# Altium project Evaluation Board.PrjPCB (part 1 of 3)
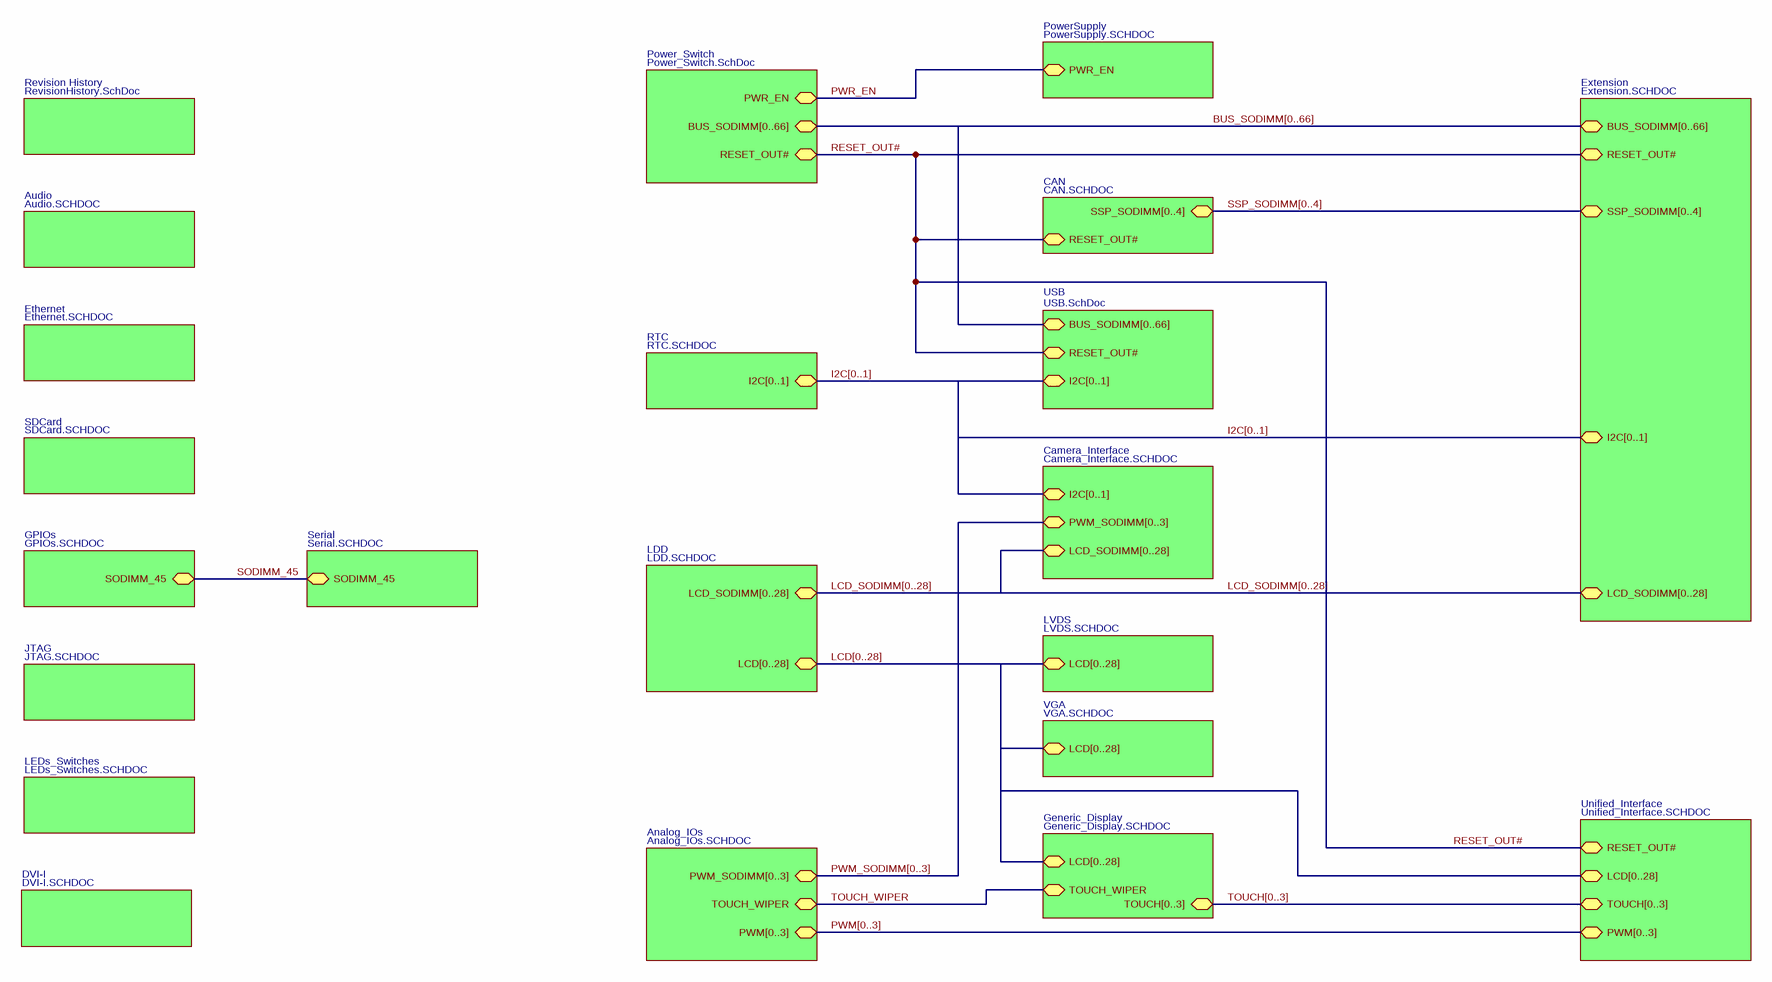
[diagram p0: Hardware_Architecture.SchDoc]
20 sheets, 461 parts. Net scope: global (net labels, ports and power ports of the same name join across sheets).
Board file: Evaluation Board.PcbDoc
Sheets:
  Hardware_Architecture.SchDoc
    LVDS = LVDS.SchDoc
    Generic_Display = Generic_Display.SchDoc
    SDCard = SDCard.SchDoc
    Extension = Extension.SCHDOC
    Ethernet = Ethernet.SchDoc
    Audio = Audio.SchDoc
    USB = USB.SchDoc
    RTC = RTC.SchDoc
    VGA = VGA.SchDoc
    Analog_IOs = Analog_IOs.SCHDOC
    Camera_Interface = Camera_Interface.SCHDOC
    Power_Switch = Power_Switch.SchDoc
    CAN = CAN.SchDoc
    JTAG = JTAG.SchDoc
    LEDs_Switches = LEDs_Switches.SchDoc
    GPIOs = GPIOs.SchDoc
    Unified_Interface = Unified_Interface.SchDoc
    DVI-I = DVI-I.SchDoc
    Revision History = RevisionHistory.SchDoc

## Sheet Hardware_Architecture.SchDoc: Evaluation Board 3.2
size A3; Organization: Toradex AG; Address1: Altsagenstrasse 5; Address2: Horw; Address3: 6048; Address4: Switzerland; DocumentNumber: 2; Revision: V3.2; SheetNumber: 2; SheetTotal: 23; PageSetup: Record=PageOptions|CenterHorizontal=True|CenterVertical=True|PrintScale=0.73|XCorrection=1.00|YCorrection=1.00|PrintKind=0|BorderSize=5000000|LeftOffset=0|BottomOffset=0|Orientation=2|PaperLength=1000|PaperWidth=1000|Scale=100|PaperSource=7|PrintQuality=600|MediaType=1|DitherType=10|PaperKind=A4|PrintScaleMode=1

### Sub-sheets
Analog_IOs = Analog_IOs.SCHDOC: TOUCH_WIPER (bidir), PWM_SODIMM[0..3] (bidir), PWM[0..3] (bidir)
Audio = Audio.SCHDOC: no entries
Camera_Interface = Camera_Interface.SCHDOC: I2C[0..1] (bidir), PWM_SODIMM[0..3] (bidir), LCD_SODIMM[0..28] (bidir)
CAN = CAN.SCHDOC: RESET_OUT# (bidir), SSP_SODIMM[0..4] (bidir)
DVI-I = DVI-I.SCHDOC: no entries
Ethernet = Ethernet.SCHDOC: no entries
Extension = Extension.SCHDOC: I2C[0..1] (bidir), SSP_SODIMM[0..4] (bidir), RESET_OUT# (bidir), LCD_SODIMM[0..28] (bidir), BUS_SODIMM[0..66] (bidir)
Generic_Display = Generic_Display.SCHDOC: LCD[0..28] (bidir), TOUCH_WIPER (bidir), TOUCH[0..3] (bidir)
GPIOs = GPIOs.SCHDOC: SODIMM_45 (bidir)
JTAG = JTAG.SCHDOC: no entries
LDD = LDD.SCHDOC (file not in this document): LCD[0..28] (bidir), LCD_SODIMM[0..28] (bidir)
LEDs_Switches = LEDs_Switches.SCHDOC: no entries
LVDS = LVDS.SCHDOC: LCD[0..28] (bidir)
Power_Switch = Power_Switch.SchDoc: RESET_OUT# (bidir), PWR_EN (bidir), BUS_SODIMM[0..66] (bidir)
PowerSupply = PowerSupply.SCHDOC (file not in this document): PWR_EN (bidir)
Revision History = RevisionHistory.SchDoc: no entries
RTC = RTC.SCHDOC: I2C[0..1] (bidir)
SDCard = SDCard.SCHDOC: no entries
Serial = Serial.SCHDOC (file not in this document): SODIMM_45 (bidir)
Unified_Interface = Unified_Interface.SCHDOC: LCD[0..28] (bidir), TOUCH[0..3] (bidir), PWM[0..3] (bidir), RESET_OUT# (bidir)
USB = USB.SchDoc: RESET_OUT# (bidir), I2C[0..1] (bidir), BUS_SODIMM[0..66] (bidir)
VGA = VGA.SCHDOC: LCD[0..28] (bidir)

### Nets
PWR_EN: sheet PowerSupply/PWR_EN, sheet Power_Switch/PWR_EN
RESET_OUT#: sheet Extension/RESET_OUT#, sheet USB/RESET_OUT#, sheet Power_Switch/RESET_OUT#, sheet CAN/RESET_OUT#, sheet Unified_Interface/RESET_OUT#
SODIMM_45: sheet Serial/SODIMM_45, sheet GPIOs/SODIMM_45
TOUCH_WIPER: sheet Generic_Display/TOUCH_WIPER, sheet Analog_IOs/TOUCH_WIPER

### Buses and harness runs
bus BUS_SODIMM[0..66] = sheet Extension/BUS_SODIMM[0..66] = sheet Power_Switch/BUS_SODIMM[0..66] = sheet USB/BUS_SODIMM[0..66]
bus I2C[0..1] = sheet Camera_Interface/I2C[0..1] = sheet Extension/I2C[0..1] = sheet RTC/I2C[0..1] = sheet USB/I2C[0..1]
bus LCD[0..28] = sheet Generic_Display/LCD[0..28] = sheet LDD/LCD[0..28] = sheet LVDS/LCD[0..28] = sheet Unified_Interface/LCD[0..28] = sheet VGA/LCD[0..28]
bus LCD_SODIMM[0..28] = sheet Camera_Interface/LCD_SODIMM[0..28] = sheet Extension/LCD_SODIMM[0..28] = sheet LDD/LCD_SODIMM[0..28]
bus PWM[0..3] = sheet Analog_IOs/PWM[0..3] = sheet Unified_Interface/PWM[0..3]
bus PWM_SODIMM[0..3] = sheet Analog_IOs/PWM_SODIMM[0..3] = sheet Camera_Interface/PWM_SODIMM[0..3]
bus SSP_SODIMM[0..4] = sheet CAN/SSP_SODIMM[0..4] = sheet Extension/SSP_SODIMM[0..4]
bus TOUCH[0..3] = sheet Generic_Display/TOUCH[0..3] = sheet Unified_Interface/TOUCH[0..3]

### Notes on the sheet
- Title
- Size:
- Date:
- A3
- Number:
- Time:
- Revision:
- Sheet
- of
- File:

## Sheet LVDS.SchDoc: Evaluation Board 3.2
size A3; Organization: Toradex AG; Address1: Altsagenstrasse 5; Address2: Horw; Address3: 6048; Address4: Switzerland; DocumentNumber: 17; Revision: V3.2; SheetNumber: 17; SheetTotal: 23; PageSetup: Record=PageOptions|CenterHorizontal=True|CenterVertical=True|PrintScale=0.73|XCorrection=1.00|YCorrection=1.00|PrintKind=0|BorderSize=5000000|LeftOffset=0|BottomOffset=0|Orientation=2|PaperLength=1000|PaperWidth=1000|Scale=100|PaperSource=7|PrintQuality=-4|MediaType=1|DitherType=10|PaperKind=A4|PrintScaleMode=1
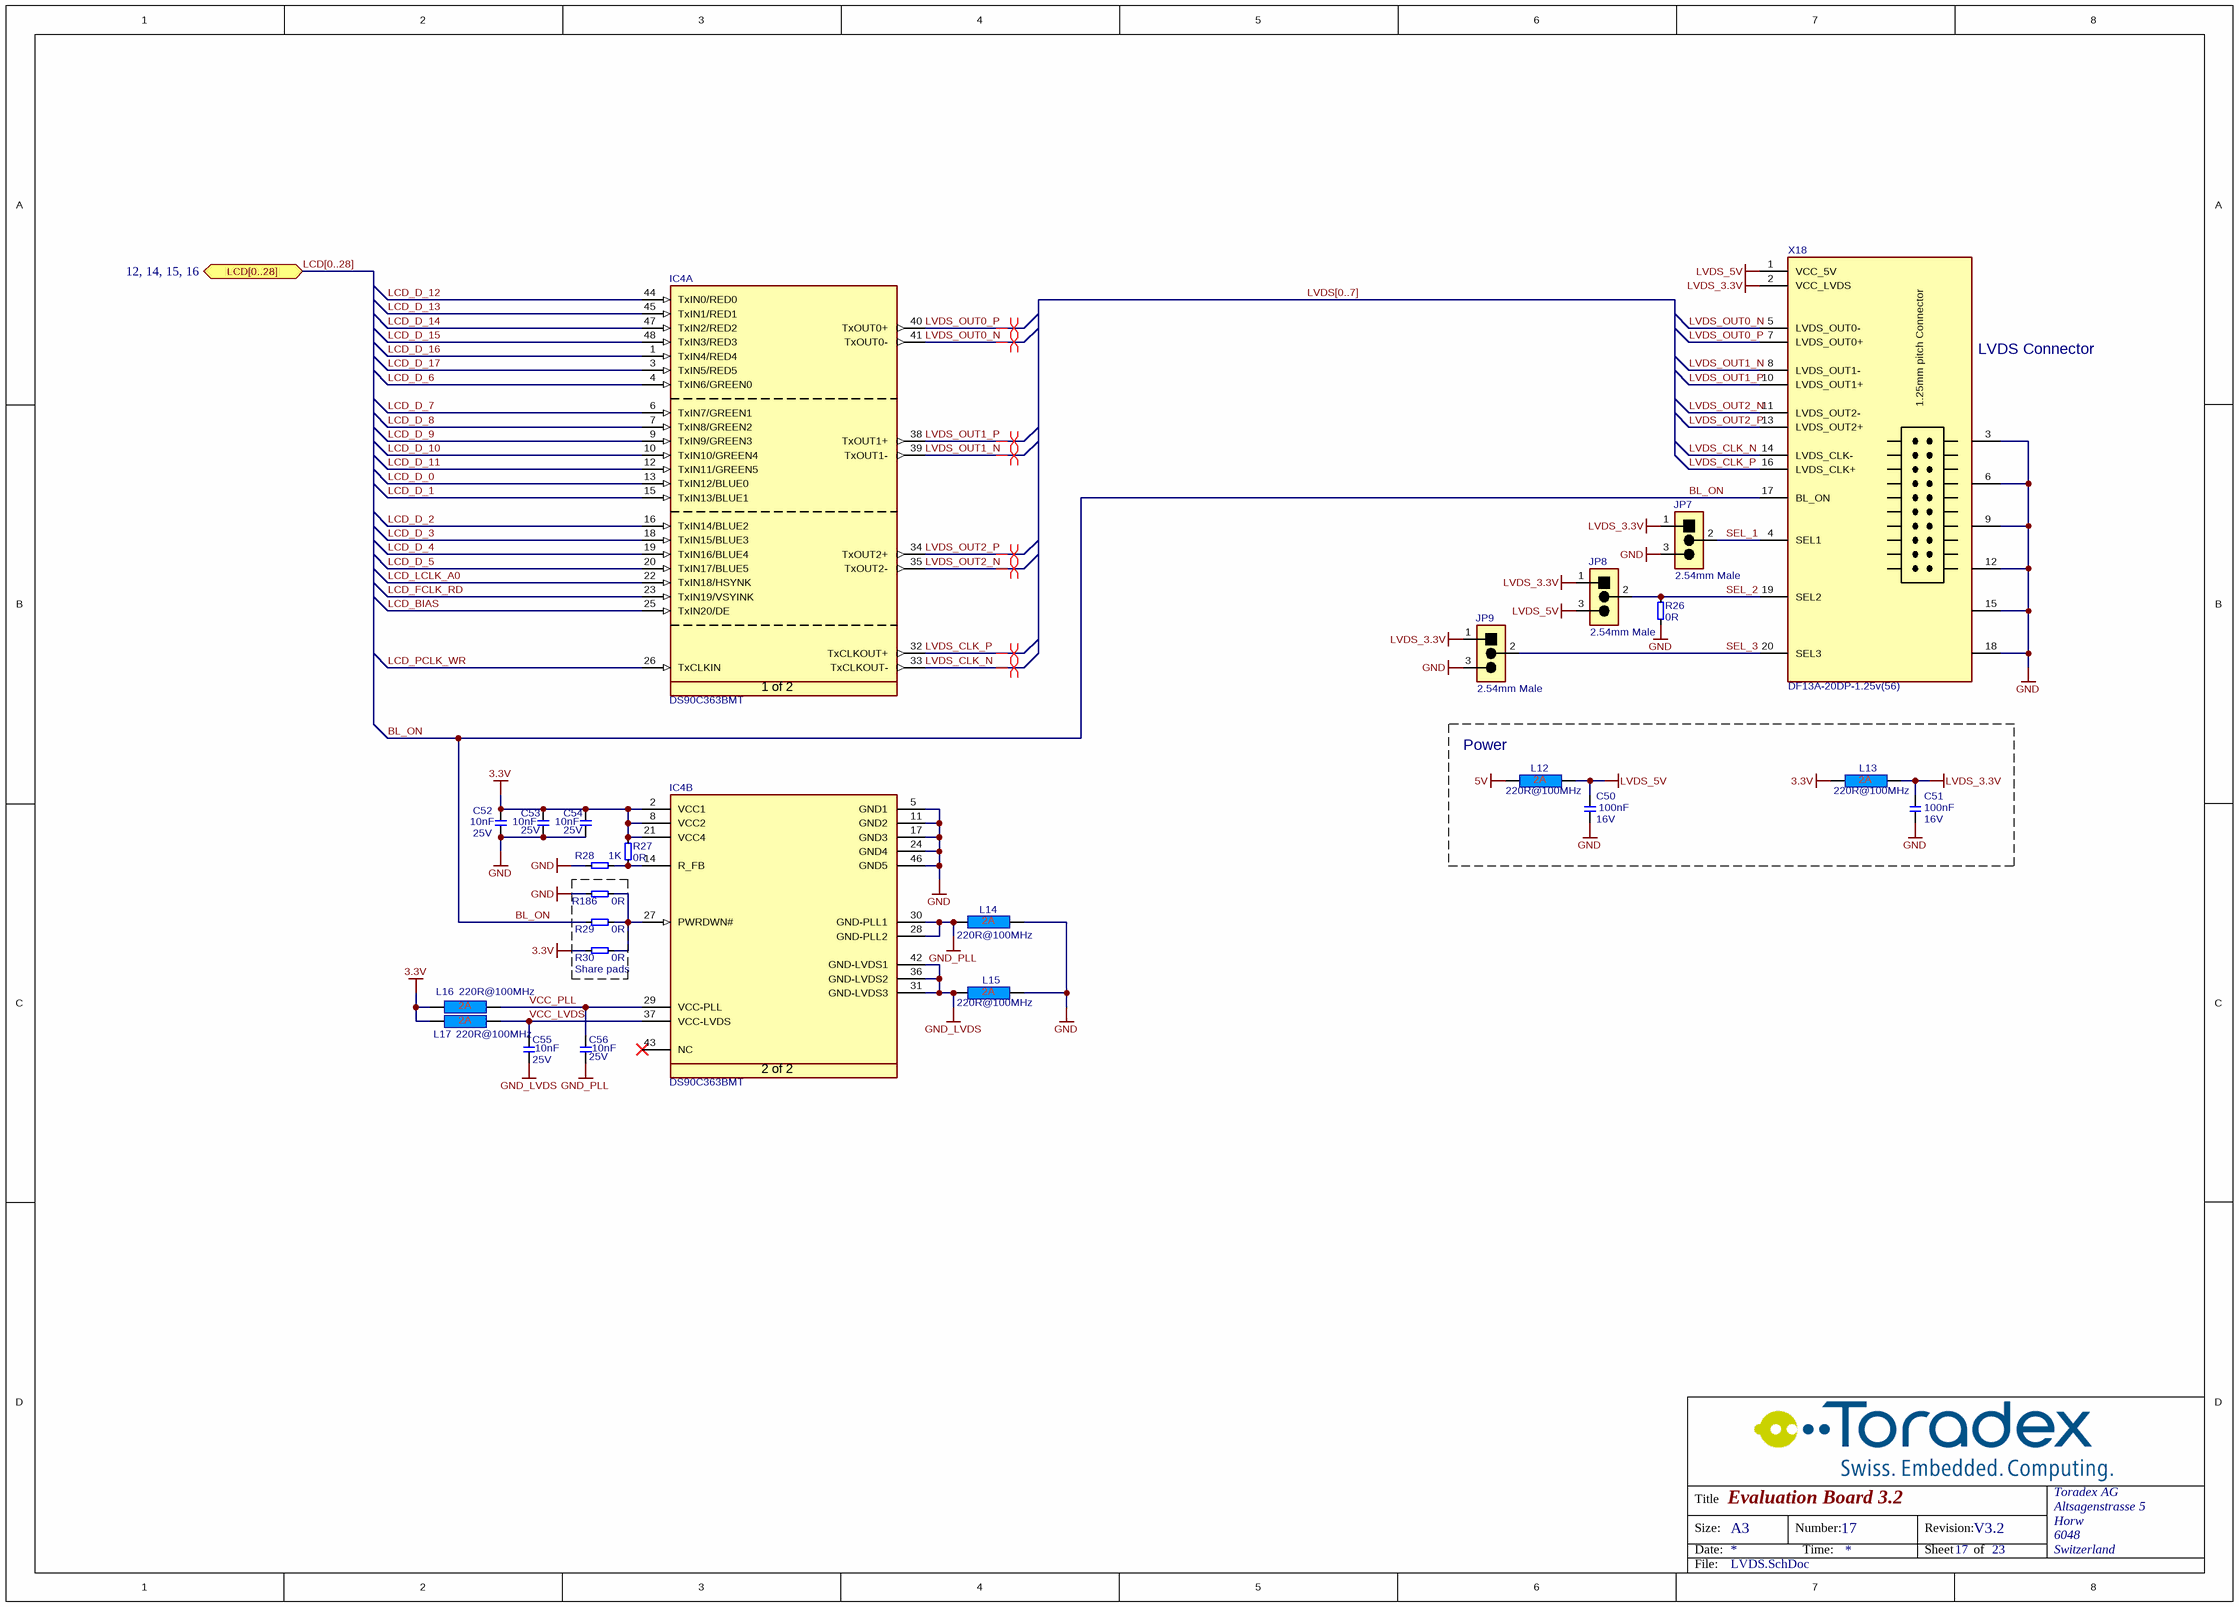
[diagram p1: LVDS.SchDoc]

### Parts
C50  Rating: 16V  [T_CAPC0603X33N]  (hidden comment: 100nF)
C51  Rating: 16V  [T_CAPC0603X33N]  (hidden comment: 100nF)
C52  Rating: 25V  [T_CAPC0603X33N]  (hidden comment: 10nF)
C53  Rating: 25V  [T_CAPC0603X33N]  (hidden comment: 10nF)
C54  Rating: 25V  [T_CAPC0603X33N]  (hidden comment: 10nF)
C55  Rating: 25V  [T_CAPC0603X33N]  (hidden comment: 10nF)
C56  Rating: 25V  [T_CAPC0603X33N]  (hidden comment: 10nF)
IC4  DS90C363BMT  [SOP50P810X120-48N]  (parts A,B of 2)
JP7  826936-3  [T_TYCO_826936-3]  (value not drawn)
JP8  826936-3  [T_TYCO_826936-3]  (value not drawn)
JP9  826936-3  [T_TYCO_826936-3]  (value not drawn)
L12  220R@100MHz  [INDC1608X95N]
L13  220R@100MHz  [INDC1608X95N]
L14  220R@100MHz  [INDC1608X95N]
L15  220R@100MHz  [INDC1608X95N]
L16  220R@100MHz  [INDC1608X95N]
L17  220R@100MHz  [INDC1608X95N]
R26  0R  [t_RESC0603X30N]
R27  0R  [t_RESC0603X30N]
R28  1K  [t_RESC0603X30N]
R29  0R  [t_RESC0603X30N]
R30  0R  [t_RESC0603X30N]
R186  0R  [t_RESC0603X30N]
X18  Manufacturer Part No.: DF13A-20DP-1.25v(56)  [T_HIROSE_DF13A-20DP-1.25V(56)]  (hidden comment: CON-Hirose-DF13A-20DP-1.25v(56)-2x10-1mm)

### Blocks framed on the sheet
Power: C50 C51 L12 L13
Share pads: R29 R30 R186

### Ports
LCD[0..28] (bidir, see 12, 14, 15, 16)

### Nets
3.3V: C52.2 C53.2 C54.2 IC4.2(VCC1) IC4.8(VCC2) IC4.21(VCC4) L13.1 L16.1 L17.1 R27.2 R30.1
5V: L12.1
GND: C50.1 C51.1 C52.1 C53.1 C54.1 IC4.5(GND1) IC4.11(GND2) IC4.17(GND3) IC4.24(GND4) IC4.46(GND5) JP7.3 JP9.3 L14.2 L15.2 R26.1 R28.1 R186.1 X18.3(GND) X18.6(GND) X18.9(GND) X18.12(GND) X18.15(GND) X18.18(GND)
GND_LVDS: C55.1 IC4.31(GND-LVDS3) IC4.36(GND-LVDS2) IC4.42(GND-LVDS1) L15.1
GND_PLL: C56.1 IC4.28(GND-PLL2) IC4.30(GND-PLL1) L14.1
LVDS_3.3V: C51.2 JP7.1 JP8.1 JP9.1 L13.2 X18.2(VCC_LVDS)
LVDS_5V: C50.2 JP8.3 L12.2 X18.1(VCC_5V)
BL_ON: R29.1 X18.17(BL_ON)
LCD_BIAS: IC4.25(TxIN20/DE)
LCD_D_0: IC4.13(TxIN12/BLUE0)
LCD_D_1: IC4.15(TxIN13/BLUE1)
LCD_D_2: IC4.16(TxIN14/BLUE2)
LCD_D_3: IC4.18(TxIN15/BLUE3)
LCD_D_4: IC4.19(TxIN16/BLUE4)
LCD_D_5: IC4.20(TxIN17/BLUE5)
LCD_D_6: IC4.4(TxIN6/GREEN0)
LCD_D_7: IC4.6(TxIN7/GREEN1)
LCD_D_8: IC4.7(TxIN8/GREEN2)
LCD_D_9: IC4.9(TxIN9/GREEN3)
LCD_D_10: IC4.10(TxIN10/GREEN4)
LCD_D_11: IC4.12(TxIN11/GREEN5)
LCD_D_12: IC4.44(TxIN0/RED0)
LCD_D_13: IC4.45(TxIN1/RED1)
LCD_D_14: IC4.47(TxIN2/RED2)
LCD_D_15: IC4.48(TxIN3/RED3)
LCD_D_16: IC4.1(TxIN4/RED4)
LCD_D_17: IC4.3(TxIN5/RED5)
LCD_FCLK_RD: IC4.23(TxIN19/VSYINK)
LCD_LCLK_A0: IC4.22(TxIN18/HSYNK)
LCD_PCLK_WR: IC4.26(TxCLKIN)
LVDS_CLK_N: IC4.33(TxCLKOUT-) X18.14(LVDS_CLK-)
LVDS_CLK_P: IC4.32(TxCLKOUT+) X18.16(LVDS_CLK+)
LVDS_OUT0_N: IC4.41(TxOUT0-) X18.5(LVDS_OUT0-)
LVDS_OUT0_P: IC4.40(TxOUT0+) X18.7(LVDS_OUT0+)
LVDS_OUT1_N: IC4.39(TxOUT1-) X18.8(LVDS_OUT1-)
LVDS_OUT1_P: IC4.38(TxOUT1+) X18.10(LVDS_OUT1+)
LVDS_OUT2_N: IC4.35(TxOUT2-) X18.11(LVDS_OUT2-)
LVDS_OUT2_P: IC4.34(TxOUT2+) X18.13(LVDS_OUT2+)
SEL_1: JP7.2 X18.4(SEL1)
SEL_2: JP8.2 R26.2 X18.19(SEL2)
SEL_3: JP9.2 X18.20(SEL3)
VCC_LVDS: C55.2 IC4.37(VCC-LVDS) L17.2
VCC_PLL: C56.2 IC4.29(VCC-PLL) L16.2
NetIC4_14: IC4.14(R_FB) R27.1 R28.2
NetIC4_27: IC4.27(PWRDWN#) R29.2 R30.2 R186.2

Not connected (* = marked no-connect by the designer): IC4 43(NC)*

### Buses and harness runs
bus LCD[0..28] = port LCD[0..28]
bus LVDS[0..7]

### Layout directives
differential pair: LVDS_CLK_N, LVDS_CLK_P, LVDS_OUT0_N, LVDS_OUT0_P, LVDS_OUT1_N, LVDS_OUT1_P, LVDS_OUT2_N, LVDS_OUT2_P

### Notes on the sheet
- (near X18) LVDS Connector
- 2.54mm Male
- (near JP9) 2.54mm Male
- Title
- Size:
- Date:
- A3
- Number:
- Time:
- Revision:
- Sheet
- of
- File:
- (in symbol CON-Hirose-DF13A-20DP-1.25v(56)-2x10-1mm) 1.25mm pitch Connector
- (in symbol IC-NS-DS90C363BMT, part A) 1 of 2
- (in symbol IC-NS-DS90C363BMT, part B) 2 of 2

### Library data of the parts
C50 C51 = C-X7R-100nF-16V-10%-0603: Capacitor Ceramic X7R 100nF 16V 10% 0603; Tolerance: 10%; Type: X7R; Value: 100nF
C52-C56 = C-X7R-10nF-25V-10%-0603: Capacitor Ceramic X7R 10nF 25V 10% 0603; Tolerance: 10%; Type: X7R; Value: 10nF
IC4 = IC-NS-DS90C363BMT: LVDS Converter; Manufacturer Name: National Semiconductor; Manufacturer Part No.: DS90C363BMT
JP7-JP9 = CON-Tyco-826936-3-1X3-2.54mm-JP: Jumper, 3-Pin; Manufacturer Name: Tyco; No. of ways: 1X3; Pitch: 2.54mm; Manufacturer Part No.: 826936-3
L12-L17 = L-220R@100MHz-2A-25%-0603: 220R@100MHz 2A EMI FILTER; Tolerance: 25%; Rating: 2A; Value: 220R@100MHz
R26 R27 R29 R30 R186 = R-0R-63mW-1%-0603: Resistor 0 ohm 63mW 1% 0603; Rating: 63mW; Tolerance: 1%; Value: 0R
R28 = R-1KR-63mW-5%-0603: Resistor 1 Kohm 63mW 5% 0603; Rating: 63mW; Tolerance: 5%; Value: 1K
X18 = CON-Hirose-DF13A-20DP-1.25v(56)-2x10-1mm: LVDS Connector; Manufacturer Name: Hirose; No. of ways: 2x10; Pitch: 1mm

## Sheet Generic_Display.SchDoc: Evaluation Board 3.2
size A3; Organization: Toradex AG; Address1: Altsagenstrasse 5; Address2: Horw; Address3: 6048; Address4: Switzerland; DocumentNumber: 15; Revision: V3.2; SheetNumber: 15; SheetTotal: 23; PageSetup: Record=PageOptions|CenterHorizontal=True|CenterVertical=True|PrintScale=0.73|XCorrection=1.00|YCorrection=1.00|PrintKind=0|BorderSize=5000000|LeftOffset=0|BottomOffset=0|Orientation=2|PaperLength=1000|PaperWidth=1000|Scale=100|PaperSource=7|PrintQuality=-4|MediaType=1|DitherType=10|PaperKind=A4|PrintScaleMode=1
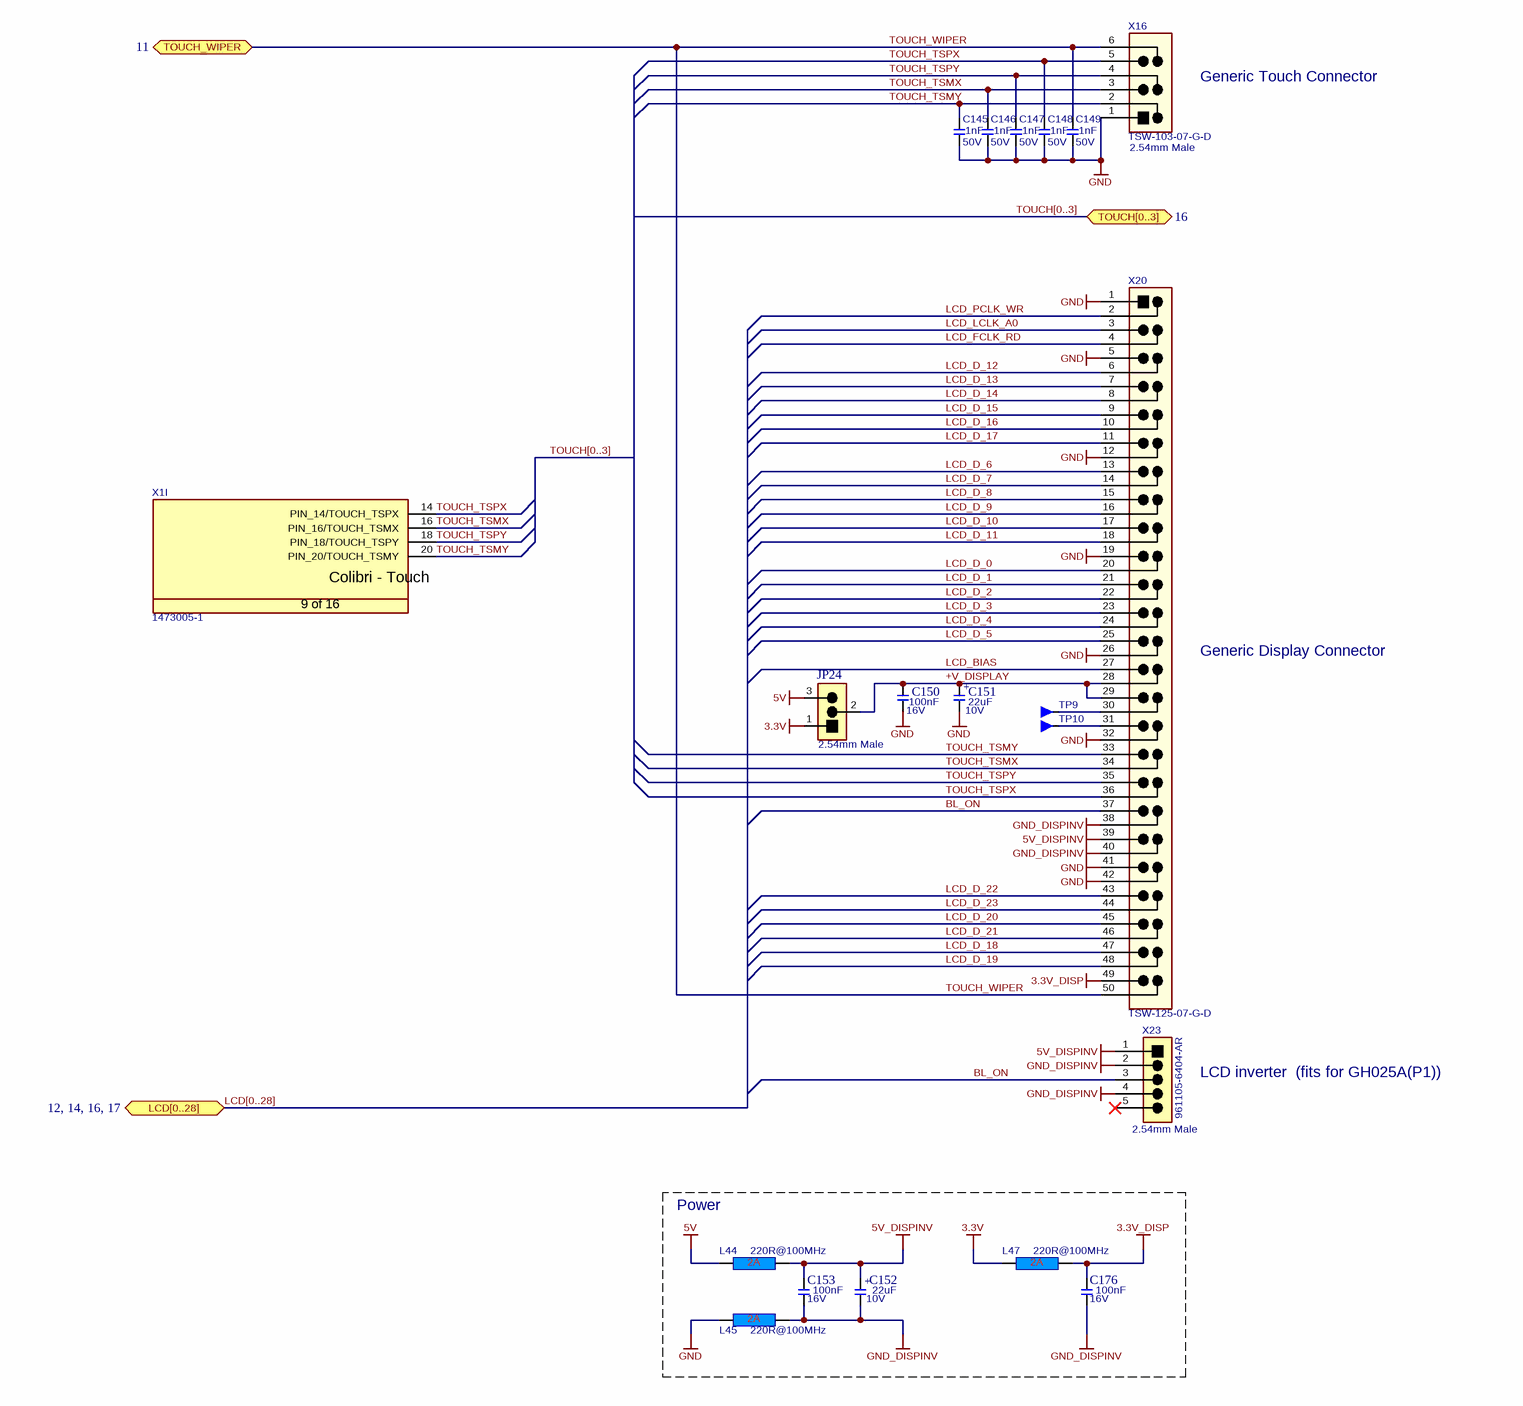
[diagram p2: Generic_Display.SchDoc]

### Parts
C145  Rating: 50V  [T_CAPC0603X33N]  (hidden comment: 1nF)
C146  Rating: 50V  [T_CAPC0603X33N]  (hidden comment: 1nF)
C147  Rating: 50V  [T_CAPC0603X33N]  (hidden comment: 1nF)
C148  Rating: 50V  [T_CAPC0603X33N]  (hidden comment: 1nF)
C149  Rating: 50V  [T_CAPC0603X33N]  (hidden comment: 1nF)
C150  Rating: 16V  [T_CAPC0603X33N]  (hidden comment: 100nF)
C151  Rating: 10V  [CAPMP3528X210N]  (hidden comment: 22uF)
C152  Rating: 10V  [CAPMP3528X210N]  (hidden comment: 22uF)
C153  Rating: 16V  [T_CAPC0603X33N]  (hidden comment: 100nF)
C176  Rating: 16V  [T_CAPC0603X33N]  (hidden comment: 100nF)
JP24  826936-3  [T_TYCO_826936-3]  (value not drawn)
L44  220R@100MHz  [INDC1608X95N]
L45  220R@100MHz  [INDC1608X95N]
L47  220R@100MHz  [INDC1608X95N]
TP9  Testpin  [T_TP-THT]  (value not drawn)
TP10  Testpin  [T_TP-THT]  (value not drawn)
X1  Manufacturer Part No.: 1473005-1  [T_Tyco_1473005-1]  (hidden comment: CON-Tyco-1473005-1-200-0.6mm)  (part I of 16)
X16  TSW-103-07-G-D  [T_Samtec_TSW-103-07-G-D]
X20  TSW-125-07-G-D  [T_SAMTEC_TSW-125-07-G-D]
X23  961105-6404-AR  [T_3M_961105-6404-AR]

### Blocks framed on the sheet
Power: C152 C153 C176 L44 L45 L47

### Ports
LCD[0..28] (bidir, see 12, 14, 16, 17), TOUCH[0..3] (bidir, see 16), TOUCH_WIPER (bidir, see 11)

### Nets
3.3V: JP24.1 L47.1
3.3V_DISP: C176.2 L47.2 X20.49
5V: JP24.3 L44.1
5V_DISPINV: C152.1 C153.2 L44.2 X20.39 X23.1
GND: C145.1 C146.1 C147.1 C148.1 C149.1 C150.1 C151.2 L45.1 X16.1 X20.1 X20.5 X20.12 X20.19 X20.26 X20.32 X20.41 X20.42
GND_DISPINV: C152.2 C153.1 C176.1 L45.2 X20.38 X20.40 X23.2 X23.4
+V_DISPLAY: C150.2 C151.1 JP24.2 X20.28 X20.29
BL_ON: X20.37 X23.3
LCD_BIAS: X20.27
LCD_D_0: X20.20
LCD_D_1: X20.21
LCD_D_2: X20.22
LCD_D_3: X20.23
LCD_D_4: X20.24
LCD_D_5: X20.25
LCD_D_6: X20.13
LCD_D_7: X20.14
LCD_D_8: X20.15
LCD_D_9: X20.16
LCD_D_10: X20.17
LCD_D_11: X20.18
LCD_D_12: X20.6
LCD_D_13: X20.7
LCD_D_14: X20.8
LCD_D_15: X20.9
LCD_D_16: X20.10
LCD_D_17: X20.11
LCD_D_18: X20.47
LCD_D_19: X20.48
LCD_D_20: X20.45
LCD_D_21: X20.46
LCD_D_22: X20.43
LCD_D_23: X20.44
LCD_FCLK_RD: X20.4
LCD_LCLK_A0: X20.3
LCD_PCLK_WR: X20.2
TOUCH_TSMX: C146.2 X1.16(PIN_16/TOUCH_TSMX) X16.3 X20.34
TOUCH_TSMY: C145.2 X1.20(PIN_20/TOUCH_TSMY) X16.2 X20.33
TOUCH_TSPX: C148.2 X1.14(PIN_14/TOUCH_TSPX) X16.5 X20.36
TOUCH_TSPY: C147.2 X1.18(PIN_18/TOUCH_TSPY) X16.4 X20.35
TOUCH_WIPER: C149.2 X16.6 X20.50 ; port TOUCH_WIPER
NetTP9_1: TP9.1 X20.30
NetTP10_1: TP10.1 X20.31

Not connected (* = marked no-connect by the designer): X23 5*

### Buses and harness runs
bus LCD[0..28] = port LCD[0..28]
bus TOUCH[0..3] = port TOUCH[0..3]

### Notes on the sheet
- Generic Touch Connector
- (near X16) 2.54mm Male
- Generic Display Connector
- (near JP24) 2.54mm Male
- (near X23) LCD inverter  (fits for GH025A(P1))
- (near X23) 2.54mm Male
- Title
- Size:
- Date:
- A3
- Number:
- Time:
- Revision:
- Sheet
- of
- File:
- (in symbol C-TA-22uF-10V-20%-3528) +
- (in symbol CON-Tyco-1473005-1-200-0.6mm, part I) Colibri - Touch; 9 of 16

### Library data of the parts
C145-C149 = C-X7R-1nF-50V-10%-0603: Capacitor Ceramic X7R 1nF 50V 10% 0603; Tolerance: 10%; Type: X7R; Value: 1nF
C150 C153 C176 = C-X7R-100nF-16V-10%-0603: Capacitor Ceramic X7R 100nF 16V 10% 0603; Tolerance: 10%; Type: X7R; Value: 100nF
C151 C152 = C-TA-22uF-10V-20%-3528: Capacitor TA 22uF 10V 20% 3528; Tolerance: 20%; Type: TA; Value: 22uF
JP24 = CON-Tyco-826936-3-1X3-2.54mm-JP: as JP7 on sheet LVDS; Manufacturer Part No.: 826936-3
L44 L45 L47 = L-220R@100MHz-2A-25%-0603: as L12 on sheet LVDS; Rating: 2A; Value: 220R@100MHz
TP9 TP10 = Testpin: Testpin TH
X1 = CON-Tyco-1473005-1-200-0.6mm: SODIMM Connector; Manufacturer Name: Tyco; No. of ways: 200
X16 = CON-Samtec-TSW-103-07-G-D: Header Male, 2x3 Pins, 2.54mm pitch; Manufacturer Name: Samtec; No. of. ways: 2x3; Pitch: 2.54mm; Manufacturer Part No.: TSW-103-07-G-D
X20 = CON-Samtec-TSW-125-07-G-D: Header, 2x25 Pins, 2.54 mm pitch; Manufacturer Name: Samtec; Pitch: 2.54mm; No. of ways: 2x25; Manufacturer Part No.: TSW-125-07-G-D
X23 = CON-3M-961105-6404-AR: Audio Header 5 pins 2.54mm; Manufacturer Name: 3M; No. of ways: 1X5; Pitch: 2.54mm; Manufacturer Part No.: 961105-6404-AR

## Sheet SDCard.SchDoc: Evaluation Board 3.2
size A3; Organization: Toradex AG; Address1: Altsagenstrasse 5; Address2: Horw; Address3: 6048; Address4: Switzerland; DocumentNumber: 7; Revision: V3.2; SheetNumber: 7; SheetTotal: 23; PageSetup: Record=PageOptions|CenterHorizontal=True|CenterVertical=True|PrintScale=0.73|XCorrection=1.00|YCorrection=1.00|PrintKind=0|BorderSize=5000000|LeftOffset=0|BottomOffset=0|Orientation=2|PaperLength=1000|PaperWidth=1000|Scale=100|PaperSource=7|PrintQuality=-4|MediaType=1|DitherType=10|PaperKind=A4|PrintScaleMode=1
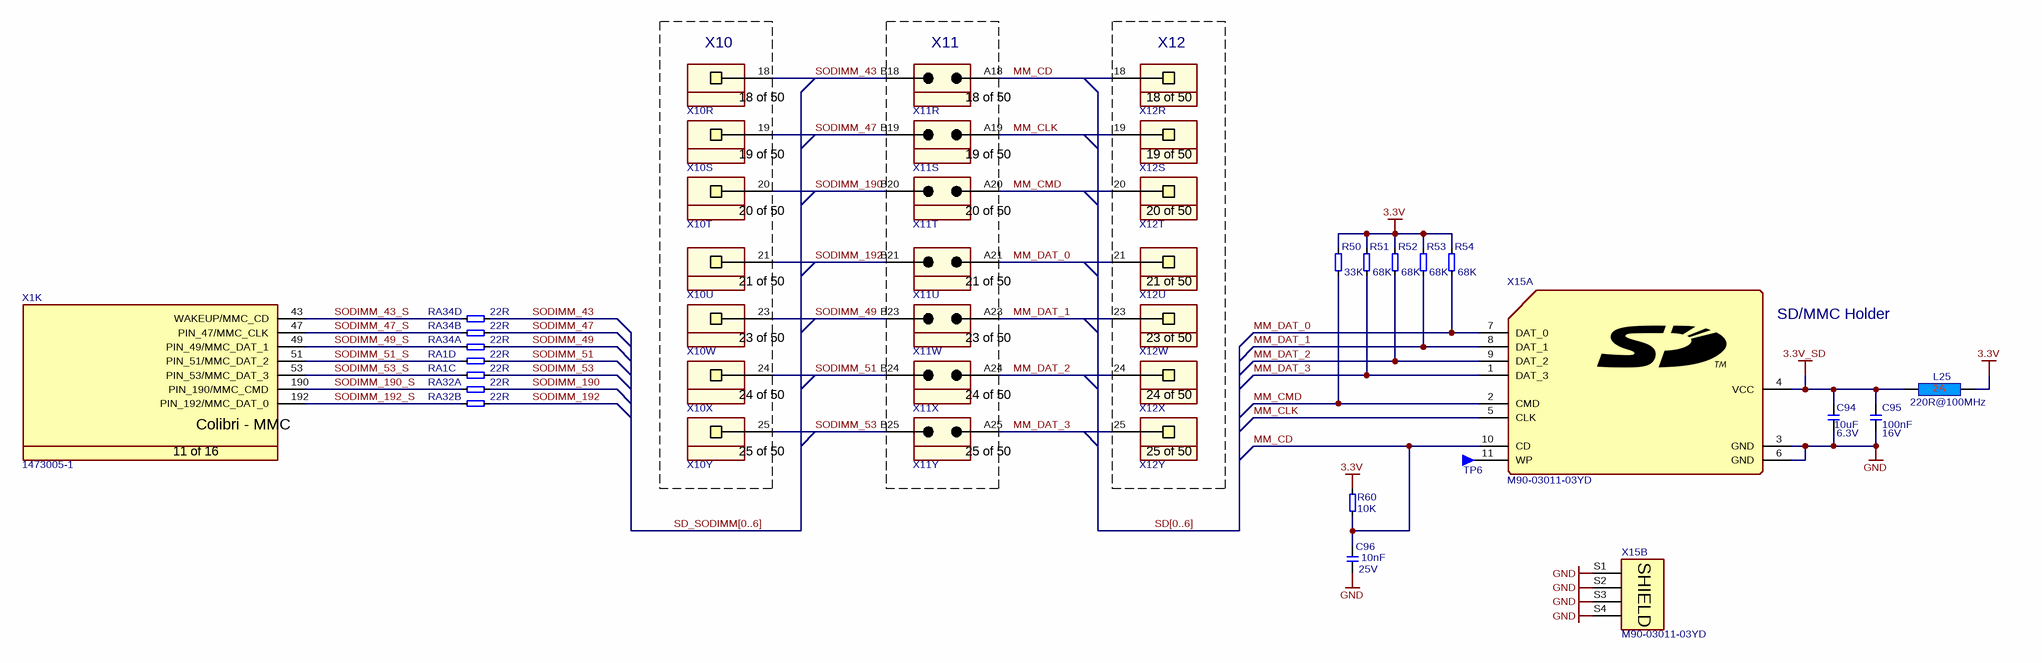
[diagram p3: SDCard.SchDoc]

### Parts
C94  Rating: 6.3V  [T_CAPC0603X33N]  (hidden comment: 10uF)
C95  Rating: 16V  [T_CAPC0603X33N]  (hidden comment: 100nF)
C96  Rating: 25V  [T_CAPC0603X33N]  (hidden comment: 10nF)
L25  220R@100MHz  [INDC1608X95N]
R50  33K  [T_RESC0603X30N]
R51  68K  [T_RESC0603X30N]
R52  68K  [T_RESC0603X30N]
R53  68K  [T_RESC0603X30N]
R54  68K  [T_RESC0603X30N]
R60  10K  [T_RESC0603X30N]
RA1  22R  [T_Resistor_Array_X4]  (parts C,D of 4)
RA32  22R  [T_Resistor_Array_X4]  (parts A,B of 4)
RA34  22R  [T_Resistor_Array_X4]  (parts A,B,D of 4)
TP6  Testpin  [T_TP-THT]  (value not drawn)
X1  Manufacturer Part No.: 1473005-1  [T_Tyco_1473005-1]  (hidden comment: CON-Tyco-1473005-1-200-0.6mm)  (part K of 16)
X10  SSW-110-01-G-S  [T_Samtec_SSW-110-01-G-S]  (value not drawn)  (parts R,S,T,U,W,X,Y of 50)
X11  TSW-110-07-G-D  [T_Samtec_TSW-110-07-G-D]  (value not drawn)  (parts R,S,T,U,W,X,Y of 50)
X12  SSW-110-01-G-S  [T_Samtec_SSW-110-01-G-S]  (value not drawn)  (parts R,S,T,U,W,X,Y of 50)
X15  Manufacturer Part No.: M90-03011-03YD  [T_ AMPHENOL_101-00708-64]  (hidden comment: MicroSD Holder)  (parts A,B of 2)

### Blocks framed on the sheet
X10: X10
X11: X11
X12: X12

### Nets
3.3V: L25.2 R50.2 R51.2 R52.2 R53.2 R54.2 R60.2
3.3V_SD: C94.2 C95.2 L25.1 X15.4(VCC)
GND: C94.1 C95.1 C96.1 X15.3(GND) X15.6(GND) X15.S1(S) X15.S2(S) X15.S3(S) X15.S4(S)
MM_CD: C96.2 R60.1 X11.A18 X12.18 X15.10(CD)
MM_CLK: X11.A19 X12.19 X15.5(CLK)
MM_CMD: R50.1 X11.A20 X12.20 X15.2(CMD)
MM_DAT_0: R54.1 X11.A21 X12.21 X15.7(DAT_0)
MM_DAT_1: R53.1 X11.A23 X12.23 X15.8(DAT_1)
MM_DAT_2: R52.1 X11.A24 X12.24 X15.9(DAT_2)
MM_DAT_3: R51.1 X11.A25 X12.25 X15.1(DAT_3)
SODIMM_43: RA34.8 X10.18 X11.B18
SODIMM_43_S: RA34.4 X1.43(WAKEUP/MMC_CD)
SODIMM_47: RA34.6 X10.19 X11.B19
SODIMM_47_S: RA34.2 X1.47(PIN_47/MMC_CLK)
SODIMM_49: RA34.5 X10.23 X11.B23
SODIMM_49_S: RA34.1 X1.49(PIN_49/MMC_DAT_1)
SODIMM_51: RA1.8 X10.24 X11.B24
SODIMM_51_S: RA1.4 X1.51(PIN_51/MMC_DAT_2)
SODIMM_53: RA1.7 X10.25 X11.B25
SODIMM_53_S: RA1.3 X1.53(PIN_53/MMC_DAT_3)
SODIMM_190: RA32.5 X10.20 X11.B20
SODIMM_190_S: RA32.1 X1.190(PIN_190/MMC_CMD)
SODIMM_192: RA32.6 X10.21 X11.B21
SODIMM_192_S: RA32.2 X1.192(PIN_192/MMC_DAT_0)
NetTP6_1: TP6.1 X15.11(WP)

### Buses and harness runs
bus SD[0..6]
bus SD_SODIMM[0..6]

### Notes on the sheet
- (near X15) SD/MMC Holder
- Title
- Size:
- Date:
- A3
- Number:
- Time:
- Revision:
- Sheet
- of
- File:
- (in symbol CON-Cenlink-M90-03011-03YD, part B) SHIELD
- (in symbol CON-Samtec-SSW-110-01-G-S, part R) 18 of 50
- (in symbol CON-Samtec-SSW-110-01-G-S, part S) 19 of 50
- (in symbol CON-Samtec-SSW-110-01-G-S, part T) 20 of 50
- (in symbol CON-Samtec-SSW-110-01-G-S, part U) 21 of 50
- (in symbol CON-Samtec-SSW-110-01-G-S, part W) 23 of 50
- (in symbol CON-Samtec-SSW-110-01-G-S, part X) 24 of 50
- (in symbol CON-Samtec-SSW-110-01-G-S, part Y) 25 of 50
- (in symbol CON-Samtec-TSW-110-07-G-D, part R) 18 of 50
- (in symbol CON-Samtec-TSW-110-07-G-D, part S) 19 of 50
- (in symbol CON-Samtec-TSW-110-07-G-D, part T) 20 of 50
- (in symbol CON-Samtec-TSW-110-07-G-D, part U) 21 of 50
- (in symbol CON-Samtec-TSW-110-07-G-D, part W) 23 of 50
- (in symbol CON-Samtec-TSW-110-07-G-D, part X) 24 of 50
- (in symbol CON-Samtec-TSW-110-07-G-D, part Y) 25 of 50
- (in symbol CON-Tyco-1473005-1-200-0.6mm, part K) Colibri - MMC; 11 of 16

### Library data of the parts
C94 = C-X5R-10uF-6.3V-20%-0603: Capacitor Ceramic X5R 10uF 6.3V 20% 0603; Tolerance: 20%; Type: X5R; Value: 10uF
C95 = C-X7R-100nF-16V-10%-0603: Capacitor Ceramic X7R 100nF 16V 10% 0603; Tolerance: 10%; Type: X7R; Value: 100nF
C96 = C-X7R-10nF-25V-10%-0603: Capacitor Ceramic X7R 10nF 25V 10% 0603; Tolerance: 10%; Type: X7R; Value: 10nF
L25 = L-220R@100MHz-2A-25%-0603: as L12 on sheet LVDS; Rating: 2A; Value: 220R@100MHz
R50 = R-33KR-63mW-5%-0603: Resistor 33 Kohm 63mW 5% 0603; Value: 33KR; Rating: 63mW; Tolerance: 5%
R51-R54 = R-68KR-63mW-5%-0603: Resistor 68 Kohm 63mW 5% 0603; Value: 68KR; Rating: 63mW; Tolerance: 5%
R60 = R-10KR-63mW-5%-0603: Resistor 10 Kohm 63mW 5% 0603; Value: 10KR; Rating: 63mW; Tolerance: 5%
RA1 RA32 RA34 = RA-22R-63mW-5%-1206-div: Resistor Array 22 R 63mW 5% 1206; Tolerance: 5%; Power Dissipation: 63mW; Value: 22R
TP6 = Testpin: Testpin TH
X1 = CON-Tyco-1473005-1-200-0.6mm: as X1 on sheet Generic_Display
X10 X12 = CON-Samtec-SSW-110-01-G-S: Header 1x50 pin 2.54mm pitch; Manufacturer Name: Samtec; Pitch: 2.54mm; No. of ways: 1x50; Manufacturer Part No.: SSW-110-01-G-S
X11 = CON-Samtec-TSW-110-07-G-D: Header 2x50 pin 2.54mm pitch; Manufacturer Name: Samtec; Pitch: 2.54mm; No. of ways: 2x50; Manufacturer Part No.: TSW-110-07-G-D
X15 = CON-Cenlink-M90-03011-03YD: SD/MMC Card Holder; No. of ways: 9+2; Manufacturer Name: Cenlink

## Sheet Extension.SCHDOC: Evaluation Board 3.2
size A3; Organization: Toradex AG; Address1: Altsagenstrasse 5; Address2: Horw; Address3: 6048; Address4: Switzerland; DocumentNumber: 22; Revision: V3.2; SheetNumber: 22; SheetTotal: 23; PageSetup: Record=PageOptions|CenterHorizontal=True|CenterVertical=True|PrintScale=0.73|XCorrection=1.00|YCorrection=1.00|PrintKind=0|BorderSize=5000000|LeftOffset=0|BottomOffset=0|Orientation=2|PaperLength=1000|PaperWidth=1000|Scale=100|PaperSource=7|PrintQuality=-4|MediaType=1|DitherType=10|PaperKind=A4|PrintScaleMode=1
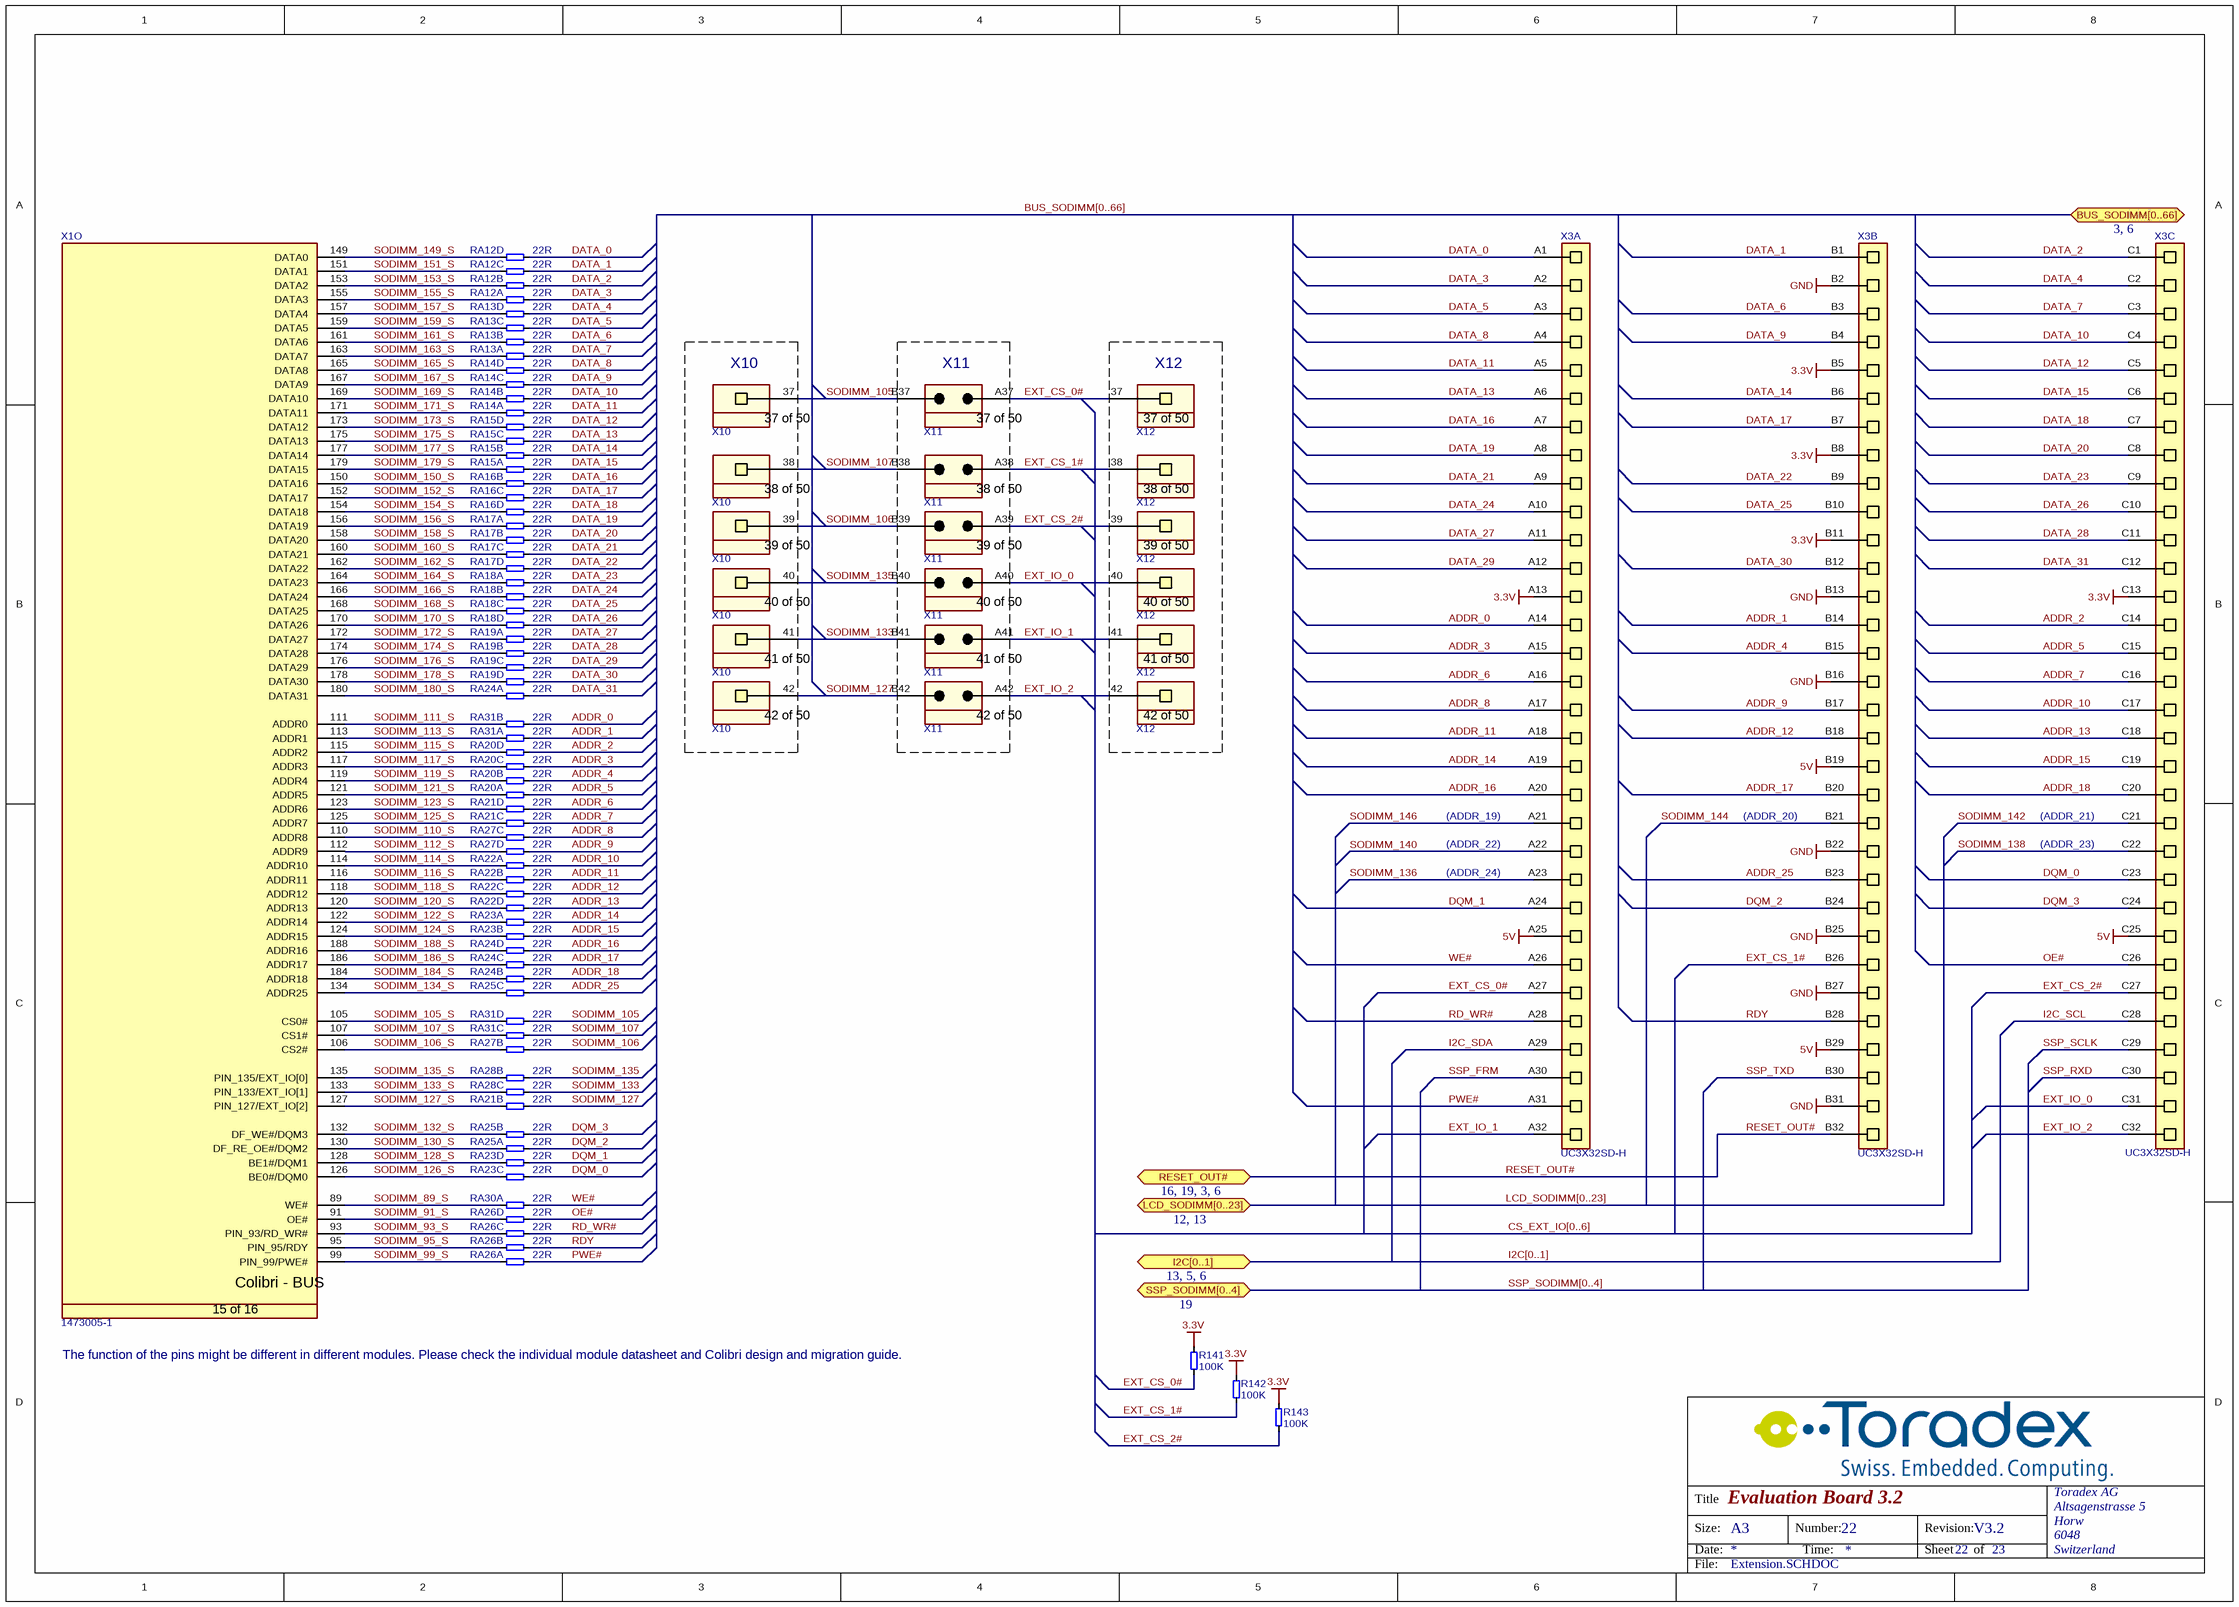
[diagram p4: Extension.SCHDOC]

### Parts
R141  100K  [T_RESC0603X30N]
R142  100K  [T_RESC0603X30N]
R143  100K  [T_RESC0603X30N]
RA12  22R  [T_Resistor_Array_X4]  (parts A,B,C,D of 4)
RA13  22R  [T_Resistor_Array_X4]  (parts A,B,C,D of 4)
RA14  22R  [T_Resistor_Array_X4]  (parts A,B,C,D of 4)
RA15  22R  [T_Resistor_Array_X4]  (parts A,B,C,D of 4)
RA16  22R  [T_Resistor_Array_X4]  (parts B,C,D of 4)
RA17  22R  [T_Resistor_Array_X4]  (parts A,B,C,D of 4)
RA18  22R  [T_Resistor_Array_X4]  (parts A,B,C,D of 4)
RA19  22R  [T_Resistor_Array_X4]  (parts A,B,C,D of 4)
RA20  22R  [T_Resistor_Array_X4]  (parts A,B,C,D of 4)
RA21  22R  [T_Resistor_Array_X4]  (parts B,C,D of 4)
RA22  22R  [T_Resistor_Array_X4]  (parts A,B,C,D of 4)
RA23  22R  [T_Resistor_Array_X4]  (parts A,B,C,D of 4)
RA24  22R  [T_Resistor_Array_X4]  (parts A,B,C,D of 4)
RA25  22R  [T_Resistor_Array_X4]  (parts A,B,C of 4)
RA26  22R  [T_Resistor_Array_X4]  (parts A,B,C,D of 4)
RA27  22R  [T_Resistor_Array_X4]  (parts B,C,D of 4)
RA28  22R  [T_Resistor_Array_X4]  (parts B,C of 4)
RA30  22R  [T_Resistor_Array_X4]  (part A of 4)
RA31  22R  [T_Resistor_Array_X4]  (parts A,B,C,D of 4)
X1  Manufacturer Part No.: 1473005-1  [T_Tyco_1473005-1]  (hidden comment: CON-Tyco-1473005-1-200-0.6mm)  (part O of 16)
X3  UC3X32SD-H  [T_AUK_UC3X32SD-H]  (parts A,B,C of 3)
X10  SSW-110-01-G-S  [T_Samtec_SSW-110-01-G-S]  (value not drawn)  (parts 37,38,39,40,41,42 of 50)
X11  TSW-110-07-G-D  [T_Samtec_TSW-110-07-G-D]  (value not drawn)  (parts 37,38,39,40,41,42 of 50)
X12  SSW-110-01-G-S  [T_Samtec_SSW-110-01-G-S]  (value not drawn)  (parts 37,38,39,40,41,42 of 50)

### Blocks framed on the sheet
X10: X10
X11: X11
X12: X12

### Ports
BUS_SODIMM[0..66] (bidir, see 3, 6), I2C[0..1] (bidir, see 13, 5, 6), LCD_SODIMM[0..23] (bidir, see 12, 13), RESET_OUT# (bidir, see 16, 19, 3, 6), SSP_SODIMM[0..4] (bidir, see 19)

### Nets
3.3V: R141.2 R142.2 R143.2 X3.A13 X3.B5 X3.B8 X3.B11 X3.C13
5V: X3.A25 X3.B19 X3.B29 X3.C25
GND: X3.B2 X3.B13 X3.B16 X3.B22 X3.B25 X3.B27 X3.B31
ADDR_0: RA31.6 X3.A14
ADDR_1: RA31.5 X3.B14
ADDR_2: RA20.8 X3.C14
ADDR_3: RA20.7 X3.A15
ADDR_4: RA20.6 X3.B15
ADDR_5: RA20.5 X3.C15
ADDR_6: RA21.8 X3.A16
ADDR_7: RA21.7 X3.C16
ADDR_8: RA27.7 X3.A17
ADDR_9: RA27.8 X3.B17
ADDR_10: RA22.5 X3.C17
ADDR_11: RA22.6 X3.A18
ADDR_12: RA22.7 X3.B18
ADDR_13: RA22.8 X3.C18
ADDR_14: RA23.5 X3.A19
ADDR_15: RA23.6 X3.C19
ADDR_16: RA24.8 X3.A20
ADDR_17: RA24.7 X3.B20
ADDR_18: RA24.6 X3.C20
ADDR_25: RA25.7 X3.B23
DATA_0: RA12.8 X3.A1
DATA_1: RA12.7 X3.B1
DATA_2: RA12.6 X3.C1
DATA_3: RA12.5 X3.A2
DATA_4: RA13.8 X3.C2
DATA_5: RA13.7 X3.A3
DATA_6: RA13.6 X3.B3
DATA_7: RA13.5 X3.C3
DATA_8: RA14.8 X3.A4
DATA_9: RA14.7 X3.B4
DATA_10: RA14.6 X3.C4
DATA_11: RA14.5 X3.A5
DATA_12: RA15.8 X3.C5
DATA_13: RA15.7 X3.A6
DATA_14: RA15.6 X3.B6
DATA_15: RA15.5 X3.C6
DATA_16: RA16.6 X3.A7
DATA_17: RA16.7 X3.B7
DATA_18: RA16.8 X3.C7
DATA_19: RA17.5 X3.A8
DATA_20: RA17.6 X3.C8
DATA_21: RA17.7 X3.A9
DATA_22: RA17.8 X3.B9
DATA_23: RA18.5 X3.C9
DATA_24: RA18.6 X3.A10
DATA_25: RA18.7 X3.B10
DATA_26: RA18.8 X3.C10
DATA_27: RA19.5 X3.A11
DATA_28: RA19.6 X3.C11
DATA_29: RA19.7 X3.A12
DATA_30: RA19.8 X3.B12
DATA_31: RA24.5 X3.C12
DQM_0: RA23.7 X3.C23
DQM_1: RA23.8 X3.A24
DQM_2: RA25.5 X3.B24
DQM_3: RA25.6 X3.C24
EXT_CS_0#: R141.1 X3.A27 X11.A37 X12.37
EXT_CS_1#: R142.1 X3.B26 X11.A38 X12.38
EXT_CS_2#: R143.1 X3.C27 X11.A39 X12.39
EXT_IO_0: X3.C31 X11.A40 X12.40
EXT_IO_1: X3.A32 X11.A41 X12.41
EXT_IO_2: X3.C32 X11.A42 X12.42
I2C_SCL: X3.C28
I2C_SDA: X3.A29
OE#: RA26.8 X3.C26
PWE#: RA26.5 X3.A31
RD_WR#: RA26.7 X3.A28
RDY: RA26.6 X3.B28
RESET_OUT#: X3.B32 ; port RESET_OUT#
SODIMM_89_S: RA30.1 X1.89(WE#)
SODIMM_91_S: RA26.4 X1.91(OE#)
SODIMM_93_S: RA26.3 X1.93(PIN_93/RD_WR#)
SODIMM_95_S: RA26.2 X1.95(PIN_95/RDY)
SODIMM_99_S: RA26.1 X1.99(PIN_99/PWE#)
SODIMM_105: RA31.8 X10.37 X11.B37
SODIMM_105_S: RA31.4 X1.105(CS0#)
SODIMM_106: RA27.6 X10.39 X11.B39
SODIMM_106_S: RA27.2 X1.106(CS2#)
SODIMM_107: RA31.7 X10.38 X11.B38
SODIMM_107_S: RA31.3 X1.107(CS1#)
SODIMM_110_S: RA27.3 X1.110(ADDR8)
SODIMM_111_S: RA31.2 X1.111(ADDR0)
SODIMM_112_S: RA27.4 X1.112(ADDR9)
SODIMM_113_S: RA31.1 X1.113(ADDR1)
SODIMM_114_S: RA22.1 X1.114(ADDR10)
SODIMM_115_S: RA20.4 X1.115(ADDR2)
SODIMM_116_S: RA22.2 X1.116(ADDR11)
SODIMM_117_S: RA20.3 X1.117(ADDR3)
SODIMM_118_S: RA22.3 X1.118(ADDR12)
SODIMM_119_S: RA20.2 X1.119(ADDR4)
SODIMM_120_S: RA22.4 X1.120(ADDR13)
SODIMM_121_S: RA20.1 X1.121(ADDR5)
SODIMM_122_S: RA23.1 X1.122(ADDR14)
SODIMM_123_S: RA21.4 X1.123(ADDR6)
SODIMM_124_S: RA23.2 X1.124(ADDR15)
SODIMM_125_S: RA21.3 X1.125(ADDR7)
SODIMM_126_S: RA23.3 X1.126(BE0#/DQM0)
SODIMM_127: RA21.6 X10.42 X11.B42
SODIMM_127_S: RA21.2 X1.127(PIN_127/EXT_IO[2])
SODIMM_128_S: RA23.4 X1.128(BE1#/DQM1)
SODIMM_130_S: RA25.1 X1.130(DF_RE_OE#/DQM2)
SODIMM_132_S: RA25.2 X1.132(DF_WE#/DQM3)
SODIMM_133: RA28.7 X10.41 X11.B41
SODIMM_133_S: RA28.3 X1.133(PIN_133/EXT_IO[1])
SODIMM_134_S: RA25.3 X1.134(ADDR25)
SODIMM_135: RA28.6 X10.40 X11.B40
SODIMM_135_S: RA28.2 X1.135(PIN_135/EXT_IO[0])
SODIMM_136: X3.A23
SODIMM_138: X3.C22
SODIMM_140: X3.A22
SODIMM_142: X3.C21
SODIMM_144: X3.B21
SODIMM_146: X3.A21
SODIMM_149_S: RA12.4 X1.149(DATA0)
SODIMM_150_S: RA16.2 X1.150(DATA16)
SODIMM_151_S: RA12.3 X1.151(DATA1)
SODIMM_152_S: RA16.3 X1.152(DATA17)
SODIMM_153_S: RA12.2 X1.153(DATA2)
SODIMM_154_S: RA16.4 X1.154(DATA18)
SODIMM_155_S: RA12.1 X1.155(DATA3)
SODIMM_156_S: RA17.1 X1.156(DATA19)
SODIMM_157_S: RA13.4 X1.157(DATA4)
SODIMM_158_S: RA17.2 X1.158(DATA20)
SODIMM_159_S: RA13.3 X1.159(DATA5)
SODIMM_160_S: RA17.3 X1.160(DATA21)
SODIMM_161_S: RA13.2 X1.161(DATA6)
SODIMM_162_S: RA17.4 X1.162(DATA22)
SODIMM_163_S: RA13.1 X1.163(DATA7)
SODIMM_164_S: RA18.1 X1.164(DATA23)
SODIMM_165_S: RA14.4 X1.165(DATA8)
SODIMM_166_S: RA18.2 X1.166(DATA24)
SODIMM_167_S: RA14.3 X1.167(DATA9)
SODIMM_168_S: RA18.3 X1.168(DATA25)
SODIMM_169_S: RA14.2 X1.169(DATA10)
SODIMM_170_S: RA18.4 X1.170(DATA26)
SODIMM_171_S: RA14.1 X1.171(DATA11)
SODIMM_172_S: RA19.1 X1.172(DATA27)
SODIMM_173_S: RA15.4 X1.173(DATA12)
SODIMM_174_S: RA19.2 X1.174(DATA28)
SODIMM_175_S: RA15.3 X1.175(DATA13)
SODIMM_176_S: RA19.3 X1.176(DATA29)
SODIMM_177_S: RA15.2 X1.177(DATA14)
SODIMM_178_S: RA19.4 X1.178(DATA30)
SODIMM_179_S: RA15.1 X1.179(DATA15)
SODIMM_180_S: RA24.1 X1.180(DATA31)
SODIMM_184_S: RA24.2 X1.184(ADDR18)
SODIMM_186_S: RA24.3 X1.186(ADDR17)
SODIMM_188_S: RA24.4 X1.188(ADDR16)
SSP_FRM: X3.A30
SSP_RXD: X3.C30
SSP_SCLK: X3.C29
SSP_TXD: X3.B30
WE#: RA30.5 X3.A26

### Buses and harness runs
bus BUS_SODIMM[0..66] = port BUS_SODIMM[0..66]
bus CS_EXT_IO[0..6]
bus I2C[0..1] = port I2C[0..1]
bus LCD_SODIMM[0..23] = port LCD_SODIMM[0..23]
bus SSP_SODIMM[0..4] = port SSP_SODIMM[0..4]

### Notes on the sheet
- (ADDR_19)
- (ADDR_20)
- (ADDR_21)
- (ADDR_22)
- (ADDR_24)
- (ADDR_23)
- The function of the pins might be different in different modules. Please check the individual module datasheet and Colibri design and migration guide.
- Title
- Size:
- Date:
- A3
- Number:
- Time:
- Revision:
- Sheet
- of
- File:
- (in symbol CON-Samtec-SSW-110-01-G-S, part 37) 37 of 50
- (in symbol CON-Samtec-SSW-110-01-G-S, part 38) 38 of 50
- (in symbol CON-Samtec-SSW-110-01-G-S, part 39) 39 of 50
- (in symbol CON-Samtec-SSW-110-01-G-S, part 40) 40 of 50
- (in symbol CON-Samtec-SSW-110-01-G-S, part 41) 41 of 50
- (in symbol CON-Samtec-SSW-110-01-G-S, part 42) 42 of 50
- (in symbol CON-Samtec-TSW-110-07-G-D, part 37) 37 of 50
- (in symbol CON-Samtec-TSW-110-07-G-D, part 38) 38 of 50
- (in symbol CON-Samtec-TSW-110-07-G-D, part 39) 39 of 50
- (in symbol CON-Samtec-TSW-110-07-G-D, part 40) 40 of 50
- (in symbol CON-Samtec-TSW-110-07-G-D, part 41) 41 of 50
- (in symbol CON-Samtec-TSW-110-07-G-D, part 42) 42 of 50
- (in symbol CON-Tyco-1473005-1-200-0.6mm, part O) Colibri - BUS; 15 of 16

### Library data of the parts
R141-R143 = R-100KR-63mW-5%-0603: Resistor 100 Kohm 63mW 5% 0603; Value: 100KR; Rating: 63mW; Tolerance: 5%
RA12-RA28 RA30 RA31 = RA-22R-63mW-5%-1206-div: Resistor Array 22 R 63mW 5% 1206; Tolerance: 5%; Power Dissipation: 63mW; Value: 22R
X1 = CON-Tyco-1473005-1-200-0.6mm: as X1 on sheet Generic_Display
X3 = CON-Auk-UC3X32SD-H: Header Female 3x32 pin 2.54mm; Manufacturer Name: Auk; Pitch: 2.54mm; No. of ways: 3x32; Manufacturer Part No.: UC3X32SD-H
X10 X12 = CON-Samtec-SSW-110-01-G-S: as X10 on sheet SDCard; Pitch: 2.54mm; No. of ways: 1x50; Manufacturer Part No.: SSW-110-01-G-S
X11 = CON-Samtec-TSW-110-07-G-D: as X11 on sheet SDCard; Pitch: 2.54mm; No. of ways: 2x50; Manufacturer Part No.: TSW-110-07-G-D

## Sheet Ethernet.SchDoc: Evaluation Board 3.2
size A3; Organization: Toradex AG; Address1: Altsagenstrasse 5; Address2: Horw; Address3: 6048; Address4: Switzerland; DocumentNumber: 8; Revision: V3.2; SheetNumber: 8; SheetTotal: 23; PageSetup: Record=PageOptions|CenterHorizontal=True|CenterVertical=True|PrintScale=0.73|XCorrection=1.00|YCorrection=1.00|PrintKind=0|BorderSize=5000000|LeftOffset=0|BottomOffset=0|Orientation=2|PaperLength=1000|PaperWidth=1000|Scale=100|PaperSource=7|PrintQuality=-4|MediaType=1|DitherType=10|PaperKind=A4|PrintScaleMode=1
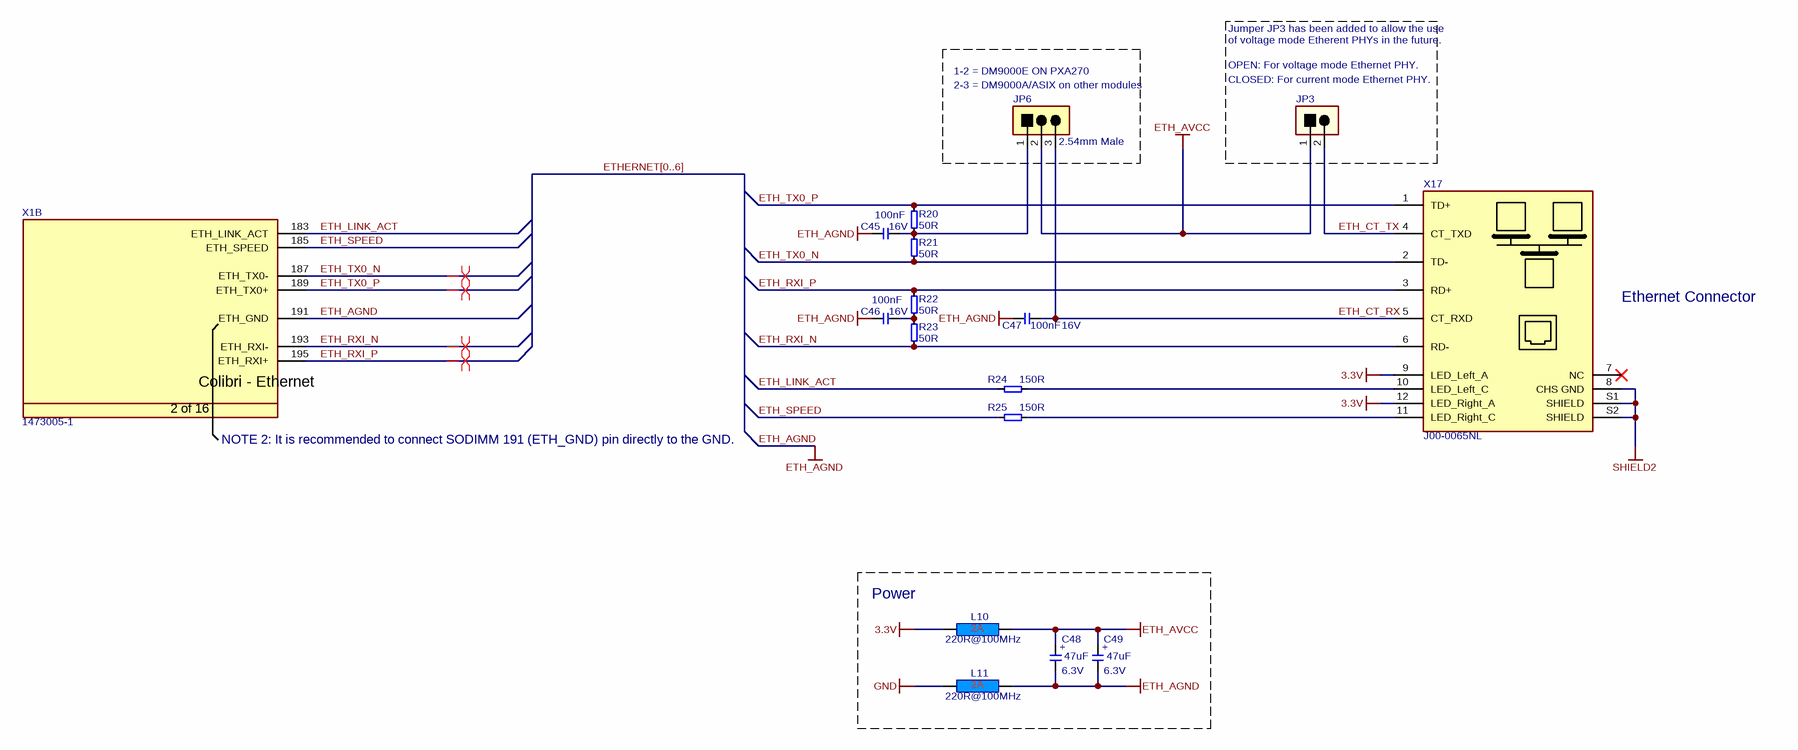
[diagram p5: Ethernet.SchDoc]

### Parts
C45  Rating: 16V  [T_CAPC0603X33N]  (hidden comment: 100nF)
C46  Rating: 16V  [T_CAPC0603X33N]  (hidden comment: 100nF)
C47  Rating: 16V  [T_CAPC0603X33N]  (hidden comment: 100nF)
C48  Rating: 6.3V  [CAPMP3528X210N]  (hidden comment: 47uF)
C49  Rating: 6.3V  [CAPMP3528X210N]  (hidden comment: 47uF)
JP3  TSW-101-07-G-D  [T_Samtec_TSW-101-07-G-D]  (value not drawn)
JP6  826936-3  [T_TYCO_826936-3]  (value not drawn)
L10  220R@100MHz  [INDC1608X95N]
L11  220R@100MHz  [INDC1608X95N]
R20  50R  [t_RESC0603X30N]
R21  50R  [t_RESC0603X30N]
R22  50R  [t_RESC0603X30N]
R23  50R  [t_RESC0603X30N]
R24  150R  [t_RESC0603X30N]
R25  150R  [t_RESC0603X30N]
X1  Manufacturer Part No.: 1473005-1  [T_Tyco_1473005-1]  (hidden comment: CON-Tyco-1473005-1-200-0.6mm)  (part B of 16)
X17  J00-0065NL  [T_Pulse_J00-0065NL]

### Blocks framed on the sheet
Power: C48 C49 L10 L11

### Nets
3.3V: L10.1 X17.9(LED_Left_A) X17.12(LED_Right_A)
ETH_AGND: C45.1 C46.1 C47.1 C48.2 C49.2 L11.2 X1.191(ETH_GND)
ETH_AVCC: C48.1 C49.1 JP3.1 JP6.2 L10.2
GND: L11.1
SHIELD2: X17.8(CHS_GND) X17.S1(SHIELD) X17.S2(SHIELD)
ETH_CT_RX: C47.2 JP6.3 X17.5(CT_RXD)
ETH_CT_TX: JP3.2 X17.4(CT_TXD)
ETH_LINK_ACT: R24.1 X1.183(ETH_LINK_ACT)
ETH_RXI_N: R23.1 X1.193(ETH_RXI-) X17.6(RD-)
ETH_RXI_P: R22.2 X1.195(ETH_RXI+) X17.3(RD+)
ETH_SPEED: R25.1 X1.185(ETH_SPEED)
ETH_TX0_N: R21.1 X1.187(ETH_TX0-) X17.2(TD-)
ETH_TX0_P: R20.2 X1.189(ETH_TX0+) X17.1(TD+)
NetC45_2: C45.2 JP6.1 R20.1 R21.2
NetC46_2: C46.2 R22.1 R23.2
NetR24_2: R24.2 X17.10(LED_Left_C)
NetR25_2: R25.2 X17.11(LED_Right_C)

Not connected (* = marked no-connect by the designer): X17 7(NC)*

### Buses and harness runs
bus ETHERNET[0..6]

### Layout directives
differential pair: ETH_RXI_N, ETH_RXI_P, ETH_TX0_N, ETH_TX0_P

### Notes on the sheet
- Jumper JP3 has been added to allow the use
- of voltage mode Etherent PHYs in the future.
- (near JP6) 1-2 = DM9000E ON PXA270
- (near JP6) 2-3 = DM9000A/ASIX on other modules
- (near JP3) CLOSED: For current mode Ethernet PHY.
- OPEN: For voltage mode Ethernet PHY.
- (near JP6) 2.54mm Male
- (near X17) Ethernet Connector
- NOTE 2: It is recommended to connect SODIMM 191 (ETH_GND) pin directly to the GND.
- Title
- Size:
- Date:
- A3
- Number:
- Time:
- Revision:
- Sheet
- of
- File:
- (in symbol C-TA-47uF-6.3V-20%-3216) +
- (in symbol CON-Tyco-1473005-1-200-0.6mm, part B) Colibri - Ethernet; 2 of 16

### Library data of the parts
C45-C47 = C-X7R-100nF-16V-10%-0603: Capacitor Ceramic X7R 100nF 16V 10% 0603; Tolerance: 10%; Type: X7R; Value: 100nF
C48 C49 = C-TA-47uF-6.3V-20%-3216: Capacitor TA 47uF 6.3V 20% 3216; Tolerance: 20%; Type: TA; Value: 47uF
JP3 = CON-Samtec-TSW-101-07-G-D: Header male, 1x2 Pins, 2.54 mm pitch; Manufacturer Name: Samtec; Pitch: 2.54 mm; No. of ways: 1x2; Manufacturer Part no.: TSW-101-07-G-D
JP6 = CON-Tyco-826936-3-1X3-2.54mm-JP: as JP7 on sheet LVDS; Manufacturer Part No.: 826936-3
L10 L11 = L-220R@100MHz-2A-25%-0603: as L12 on sheet LVDS; Rating: 2A; Value: 220R@100MHz
R20-R23 = R-50R-63mW-1%-0603: Resistor 50 ohm 63mW 1% 0603; Rating: 63mW; Tolerance: 1%; Value: 50R
R24 R25 = R-150R-63mW-1%-0603: Resistor 150 ohm 63mW 1% 0603; Tolerance: 1%; Value: 150R; Rating: 63mW
X1 = CON-Tyco-1473005-1-200-0.6mm: as X1 on sheet Generic_Display
X17 = CON-Pulse-J00-0065NL: RJ45 Connector; Manufacturer Name: Pulse; No. of ways: 12; Manufacturer Part No.: J00-0065NL

## Sheet Audio.SchDoc: Evaluation Board 3.2
size A3; Organization: Toradex AG; Address1: Altsagenstrasse 5; Address2: Horw; Address3: 6048; Address4: Switzerland; DocumentNumber: 10; Revision: V3.2; SheetNumber: 10; SheetTotal: 23; PageSetup: Record=PageOptions|CenterHorizontal=True|CenterVertical=True|PrintScale=0.73|XCorrection=1.00|YCorrection=1.00|PrintKind=0|BorderSize=5000000|LeftOffset=0|BottomOffset=0|Orientation=2|PaperLength=1000|PaperWidth=1000|Scale=100|PaperSource=7|PrintQuality=-4|MediaType=1|DitherType=10|PaperKind=A4|PrintScaleMode=1
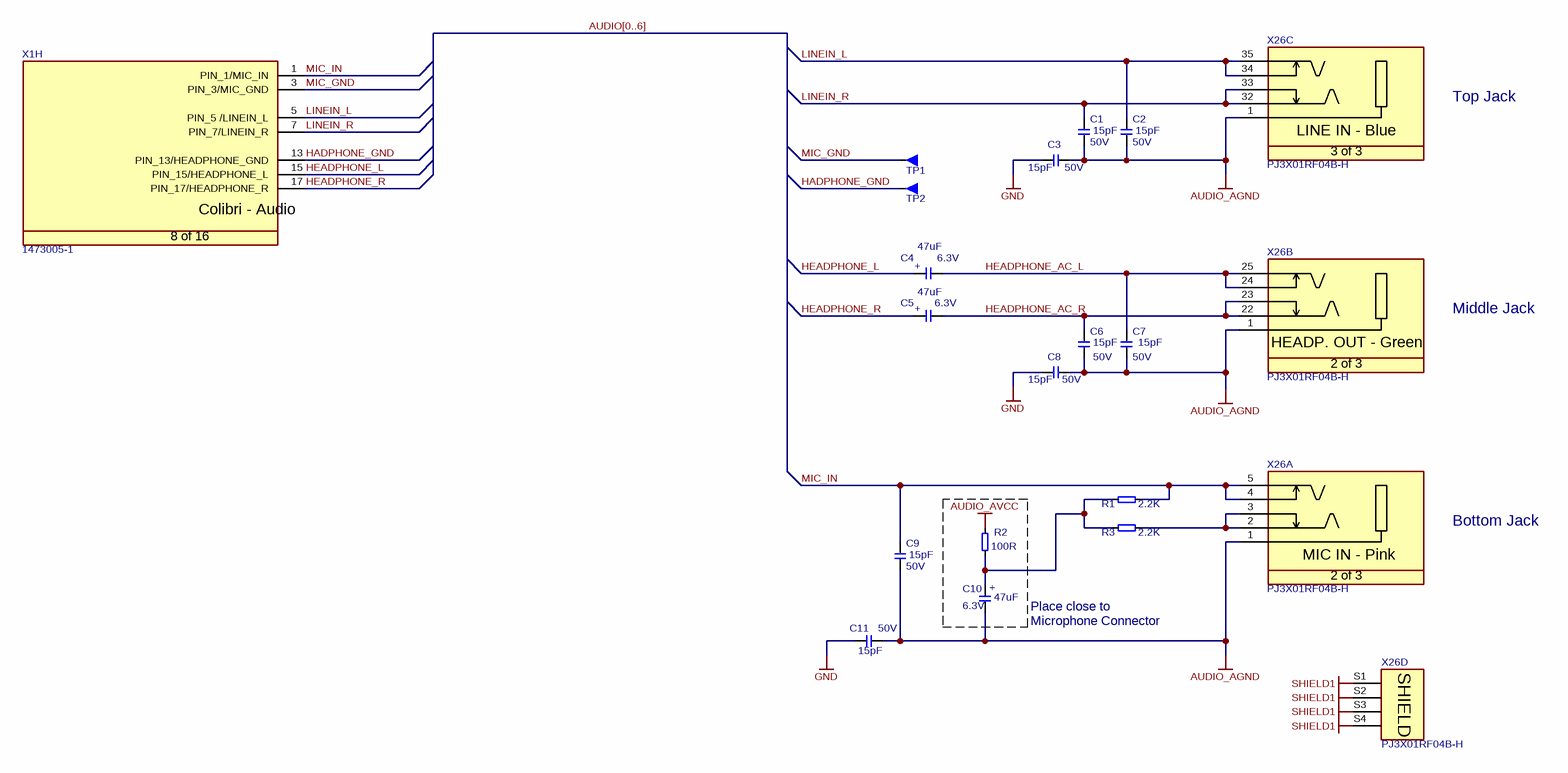
[diagram p6: Audio.SchDoc]

### Parts
C1  Rating: 50V  [T_CAPC0603X33N]  (hidden comment: 15pF)
C2  Rating: 50V  [T_CAPC0603X33N]  (hidden comment: 15pF)
C3  Rating: 50V  [T_CAPC0603X33N]  (hidden comment: 15pF)
C4  Rating: 6.3V  [CAPMP3528X210N]  (hidden comment: 47uF)
C5  Rating: 6.3V  [CAPMP3528X210N]  (hidden comment: 47uF)
C6  Rating: 50V  [T_CAPC0603X33N]  (hidden comment: 15pF)
C7  Rating: 50V  [T_CAPC0603X33N]  (hidden comment: 15pF)
C8  Rating: 50V  [T_CAPC0603X33N]  (hidden comment: 15pF)
C9  Rating: 50V  [T_CAPC0603X33N]  (hidden comment: 15pF)
C10  Rating: 6.3V  [CAPMP3528X210N]  (hidden comment: 47uF)
C11  Rating: 50V  [T_CAPC0603X33N]  (hidden comment: 15pF)
R1  2.2K  [T_RESC0603X30N]
R2  100R  [T_RESC0603X30N]
R3  2.2K  [T_RESC0603X30N]
TP1  Testpin  [T_TP-THT]  (value not drawn)
TP2  Testpin  [T_TP-THT]  (value not drawn)
X1  Manufacturer Part No.: 1473005-1  [T_Tyco_1473005-1]  (hidden comment: CON-Tyco-1473005-1-200-0.6mm)  (part H of 16)
X26  Manufacturer Part No.: PJ3X01RF04B-H  [T_AUK_PJ3X01RF04B-H]  (hidden comment: AUK-PJ3X01RF04B-H)  (parts A,B,C,D of 4)

### Nets
AUDIO_AGND: C1.1 C2.1 C3.2 C6.1 C7.1 C8.2 C9.1 C10.2 C11.1 X26.1
AUDIO_AVCC: R2.2
GND: C3.1 C8.1 C11.2
SHIELD1: X26.S1(SHIELD) X26.S2(SHIELD) X26.S3(SHIELD) X26.S4(SHIELD)
HADPHONE_GND: TP2.1 X1.13(PIN_13/HEADPHONE_GND)
HEADPHONE_AC_L: C4.2 C7.2 X26.24 X26.25
HEADPHONE_AC_R: C5.2 C6.2 X26.22 X26.23
HEADPHONE_L: C4.1 X1.15(PIN_15/HEADPHONE_L)
HEADPHONE_R: C5.1 X1.17(PIN_17/HEADPHONE_R)
LINEIN_L: C2.2 X1.5(PIN_5_/LINEIN_L) X26.34 X26.35
LINEIN_R: C1.2 X1.7(PIN_7/LINEIN_R) X26.32 X26.33
MIC_GND: TP1.1 X1.3(PIN_3/MIC_GND)
MIC_IN: C9.2 R1.2 X1.1(PIN_1/MIC_IN) X26.4 X26.5
NetC10_1: C10.1 R1.1 R2.1 R3.1
NetR3_2: R3.2 X26.2 X26.3

### Buses and harness runs
bus AUDIO[0..6]

### Notes on the sheet
- Top Jack
- Middle Jack
- Bottom Jack
- Place close to
- (near C10) Microphone Connector
- Title
- Size:
- Date:
- A3
- Number:
- Time:
- Revision:
- Sheet
- of
- File:
- (in symbol C-TA-47uF-6.3V-20%-3216) +
- (in symbol CON-AUK-PJ3X01RF04B-H, part A) MIC IN - Pink; 2 of 3
- (in symbol CON-AUK-PJ3X01RF04B-H, part B) HEADP. OUT - Green; 2 of 3
- (in symbol CON-AUK-PJ3X01RF04B-H, part C) LINE IN - Blue; 3 of 3
- (in symbol CON-Tyco-1473005-1-200-0.6mm, part H) Colibri - Audio; 8 of 16

### Library data of the parts
C1-C3 C6-C9 C11 = C-NPO-15pF-50V-10%-0603: Capacitor Ceramic NPO 15pF 50V 10% 0603; Tolerance: 10%; Type: NPO; Value: 15pF
C4 C5 C10 = C-TA-47uF-6.3V-20%-3216: Capacitor TA 47uF 6.3V 20% 3216; Tolerance: 20%; Type: TA; Value: 47uF
R1 R3 = R-2.2KR-63mW-5%-0603: Resistor 2.2Kohm 63mW 5% 0603; Value: 2.2KR; Rating: 63mW; Tolerance: 5%
R2 = R-100R-63mW-5%-0603: Resistor 100 ohm 63mW 5% 0603; Rating: 63mW; Tolerance: 5%; Value: 100R
TP1 TP2 = Testpin: Testpin TH
X1 = CON-Tyco-1473005-1-200-0.6mm: as X1 on sheet Generic_Display
X26 = CON-AUK-PJ3X01RF04B-H: 3x Audiojack stereo, 3.5mm; Manufacturer Name: AUK; No. of ways: 13

## Sheet USB.SchDoc: Evaluation Board 3.2
size A3; Organization: Toradex AG; Address1: Altsagenstrasse 5; Address2: Horw; Address3: 6048; Address4: Switzerland; DocumentNumber: 6; Revision: V3.2; SheetNumber: 6; SheetTotal: 23; PageSetup: Record=PageOptions|CenterHorizontal=True|CenterVertical=True|PrintScale=0.73|XCorrection=1.00|YCorrection=1.00|PrintKind=0|BorderSize=5000000|LeftOffset=0|BottomOffset=0|Orientation=2|PaperLength=1000|PaperWidth=1000|Scale=100|PaperSource=7|PrintQuality=-4|MediaType=1|DitherType=10|PaperKind=A4|PrintScaleMode=1
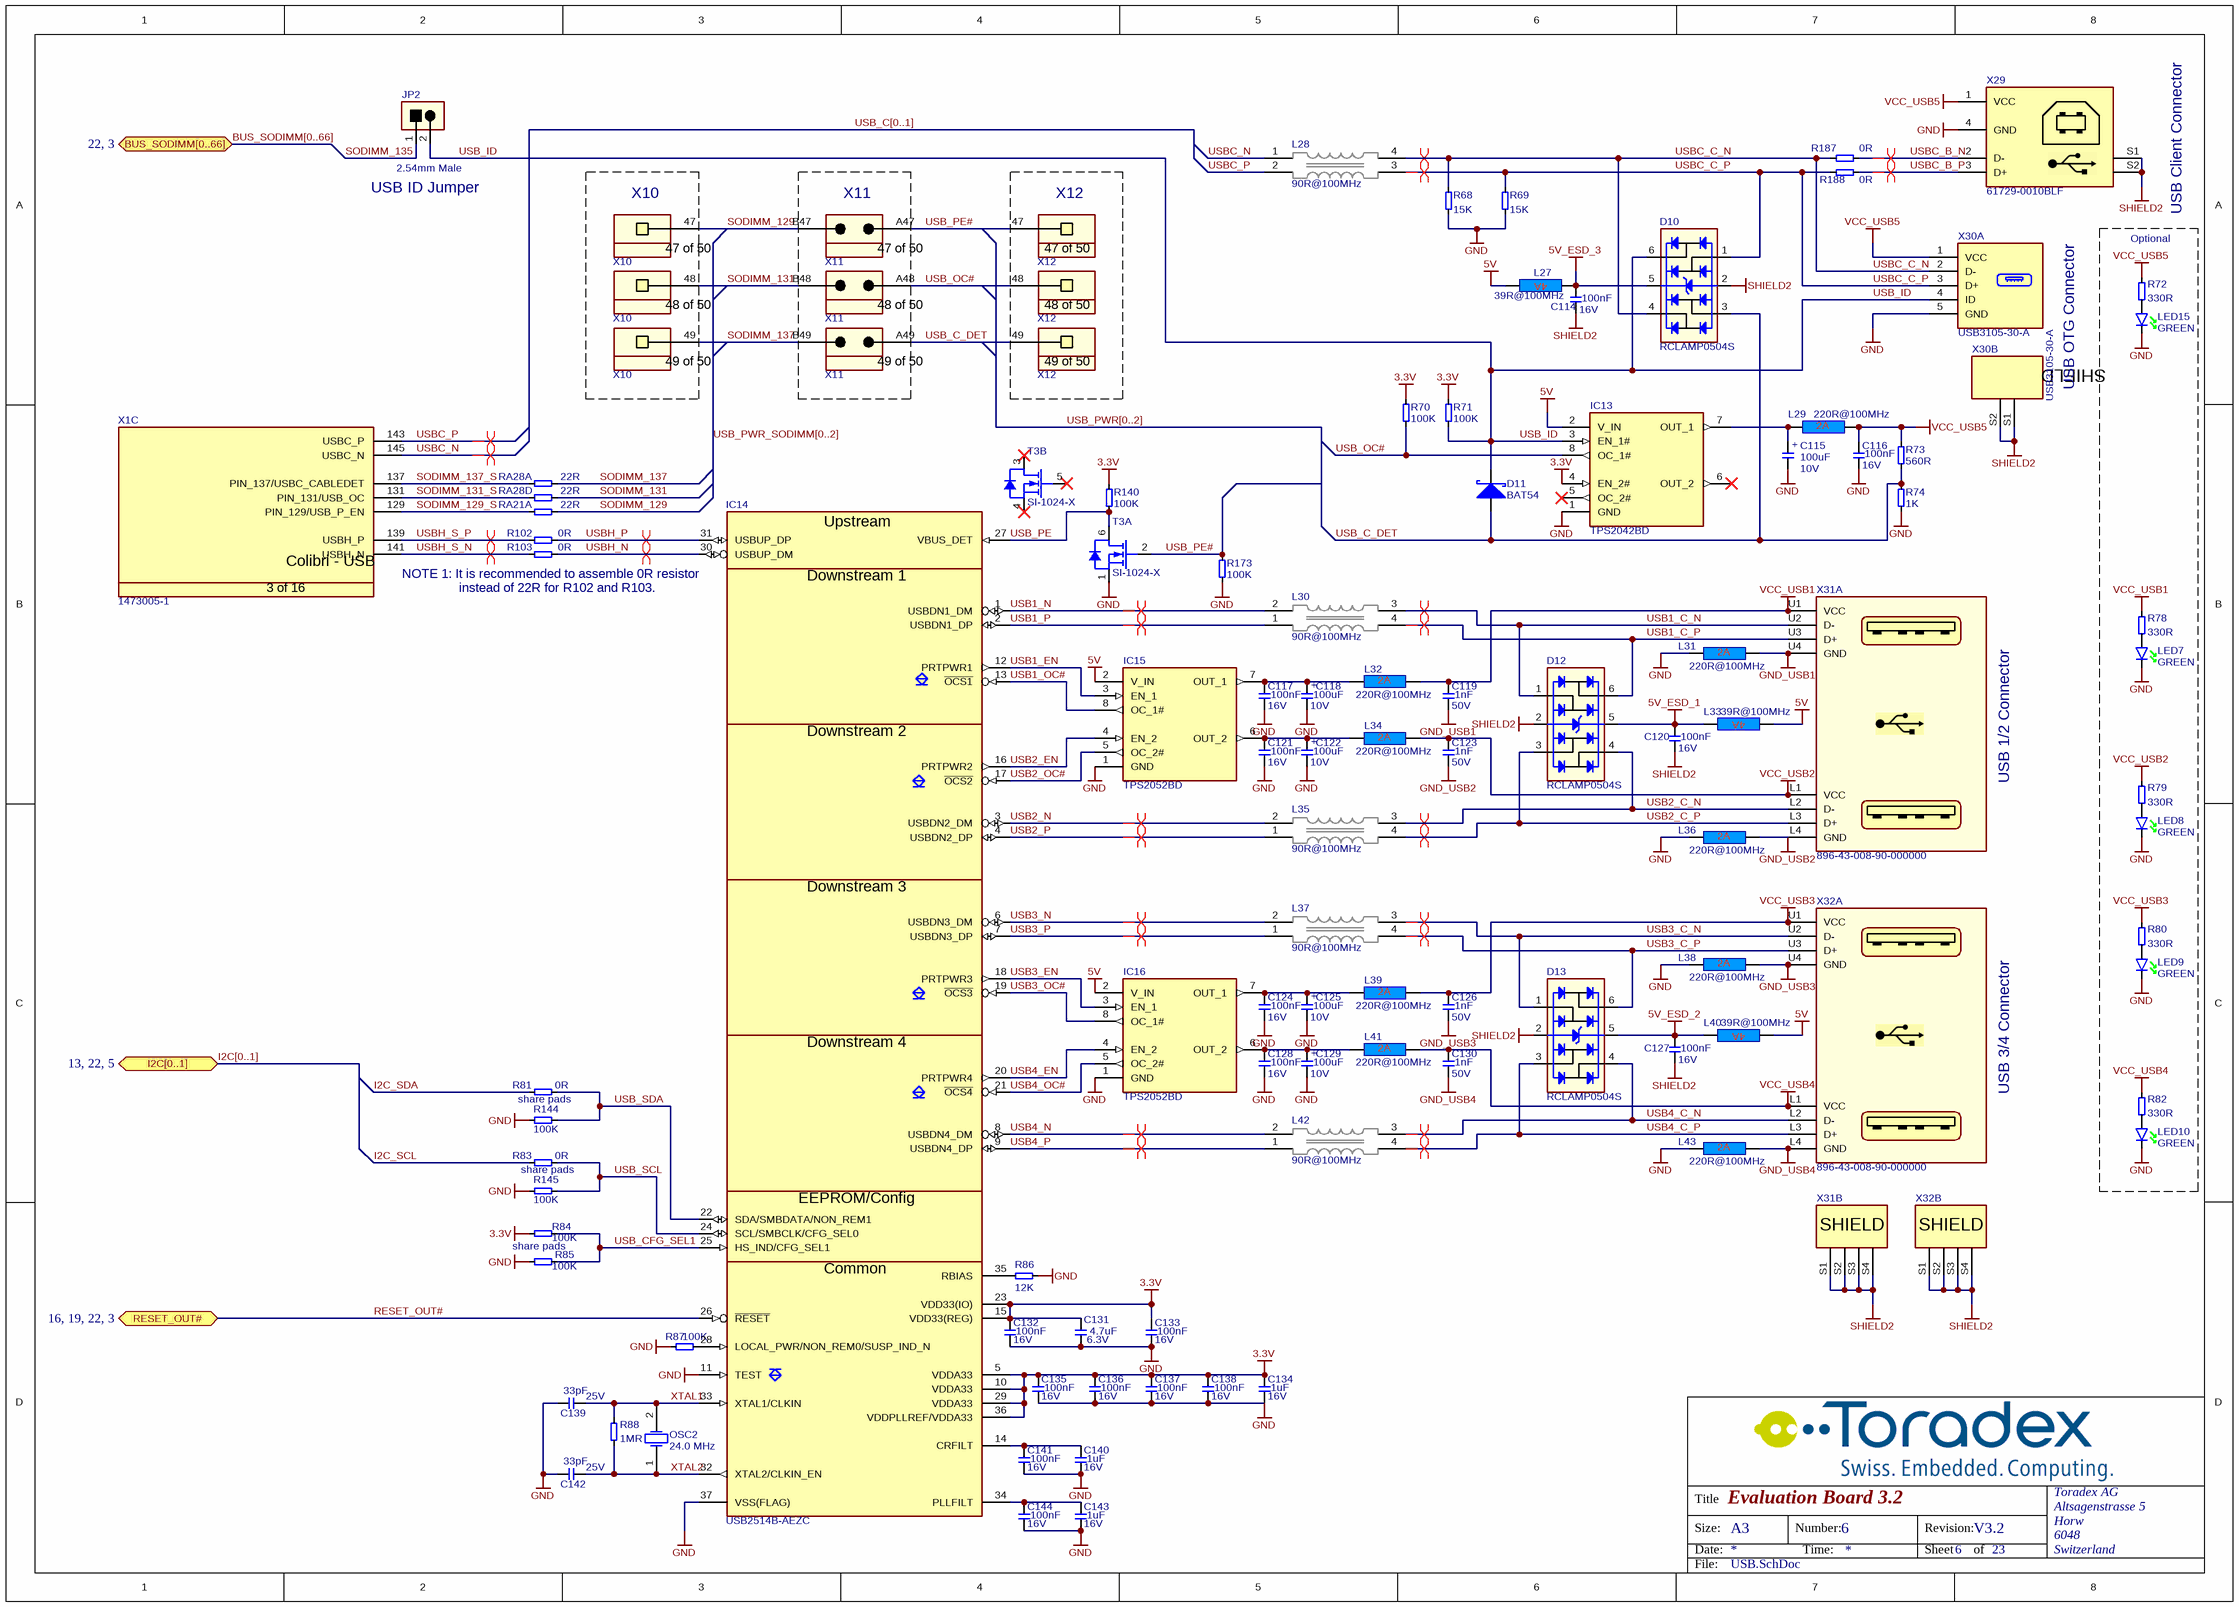
[diagram p7: USB.SchDoc]

### Parts
C114  Rating: 16V  [T_CAPC0603X33N]  (hidden comment: 100nF)
C115  Rating: 10V  [CAPMP6032X280N]  (hidden comment: 100uF)
C116  Rating: 16V  [T_CAPC0603X33N]  (hidden comment: 100nF)
C117  Rating: 16V  [T_CAPC0603X33N]  (hidden comment: 100nF)
C118  Rating: 10V  [CAPMP6032X280N]  (hidden comment: 100uF)
C119  Rating: 50V  [T_CAPC0603X33N]  (hidden comment: 1nF)
C120  Rating: 16V  [T_CAPC0603X33N]  (hidden comment: 100nF)
C121  Rating: 16V  [T_CAPC0603X33N]  (hidden comment: 100nF)
C122  Rating: 10V  [CAPMP6032X280N]  (hidden comment: 100uF)
C123  Rating: 50V  [T_CAPC0603X33N]  (hidden comment: 1nF)
C124  Rating: 16V  [T_CAPC0603X33N]  (hidden comment: 100nF)
C125  Rating: 10V  [CAPMP6032X280N]  (hidden comment: 100uF)
C126  Rating: 50V  [T_CAPC0603X33N]  (hidden comment: 1nF)
C127  Rating: 16V  [T_CAPC0603X33N]  (hidden comment: 100nF)
C128  Rating: 16V  [T_CAPC0603X33N]  (hidden comment: 100nF)
C129  Rating: 10V  [CAPMP6032X280N]  (hidden comment: 100uF)
C130  Rating: 50V  [T_CAPC0603X33N]  (hidden comment: 1nF)
C131  Rating: 6.3V  [T_CAPC0603X33N]  (hidden comment: 4.7uF)
C132  Rating: 16V  [T_CAPC0603X33N]  (hidden comment: 100nF)
C133  Rating: 16V  [T_CAPC0603X33N]  (hidden comment: 100nF)
C134  Rating: 16V  [T_CAPC0603X33N]  (hidden comment: 1uF)
C135  Rating: 16V  [T_CAPC0603X33N]  (hidden comment: 100nF)
C136  Rating: 16V  [T_CAPC0603X33N]  (hidden comment: 100nF)
C137  Rating: 16V  [T_CAPC0603X33N]  (hidden comment: 100nF)
C138  Rating: 16V  [T_CAPC0603X33N]  (hidden comment: 100nF)
C139  Rating: 25V  [T_CAPC0603X33N]  (hidden comment: 33pF)
C140  Rating: 16V  [T_CAPC0603X33N]  (hidden comment: 1uF)
C141  Rating: 16V  [T_CAPC0603X33N]  (hidden comment: 100nF)
C142  Rating: 25V  [T_CAPC0603X33N]  (hidden comment: 33pF)
C143  Rating: 16V  [T_CAPC0603X33N]  (hidden comment: 1uF)
C144  Rating: 16V  [T_CAPC0603X33N]  (hidden comment: 100nF)
D10  RCLAMP0504S  [T_SOT95P285X90-6N]
D11  BAT54  [SOT95P230X110-3N]
D12  RCLAMP0504S  [T_SOT95P285X90-6N]
D13  RCLAMP0504S  [T_SOT95P285X90-6N]
IC13  TPS2042BD  [SOIC127P600X173-8N]
IC14  Manufacturer Part No.: USB2514B-AEZC  [T_SMSC_USB2514B-AEZC]  (hidden comment: USB2514B)
IC15  TPS2052BD  [SOIC127P600X173-8N]
IC16  TPS2052BD  [SOIC127P600X173-8N]
JP2  TSW-101-07-G-D  [T_Samtec_TSW-101-07-G-D]  (value not drawn)
L27  39R@100MHz  [INDC2013X130N]
L28  90R@100MHz  [T_Murata_DLW21SN900SQ2]
L29  220R@100MHz  [INDC1608X95N]
L30  90R@100MHz  [T_Murata_DLW21SN900SQ2]
L31  220R@100MHz  [INDC1608X95N]
L32  220R@100MHz  [INDC1608X95N]
L33  39R@100MHz  [INDC2013X130N]
L34  220R@100MHz  [INDC1608X95N]
L35  90R@100MHz  [T_Murata_DLW21SN900SQ2]
L36  220R@100MHz  [INDC1608X95N]
L37  90R@100MHz  [T_Murata_DLW21SN900SQ2]
L38  220R@100MHz  [INDC1608X95N]
L39  220R@100MHz  [INDC1608X95N]
L40  39R@100MHz  [INDC2013X130N]
L41  220R@100MHz  [INDC1608X95N]
L42  90R@100MHz  [T_Murata_DLW21SN900SQ2]
L43  220R@100MHz  [INDC1608X95N]
LED7  Color: GREEN  [T_Osram_T670_GREEN]  (hidden comment: LG T670-K1L2-1)
LED8  Color: GREEN  [T_Osram_T670_GREEN]  (hidden comment: LG T670-K1L2-1)
LED9  Color: GREEN  [T_Osram_T670_GREEN]  (hidden comment: LG T670-K1L2-1)
LED10  Color: GREEN  [T_Osram_T670_GREEN]  (hidden comment: LG T670-K1L2-1)
LED15  Color: GREEN  [T_Osram_T670_GREEN]  (hidden comment: LG T670-K1L2-1)
OSC2  value 24.0 MHz  [T_HORIZON-HEX24]  (hidden comment: HEX24-24000MHz-18-50R-F-H2-T2-W2-T)
R68  15K  [T_RESC0603X30N]
R69  15K  [T_RESC0603X30N]
R70  100K  [t_RESC0603X30N]
R71  100K  [t_RESC0603X30N]
R72  330R  [T_RESC0603X30N]
R73  560R  [T_RESC0603X30N]
R74  1K  [T_RESC0603X30N]
R78  330R  [T_RESC0603X30N]
R79  330R  [T_RESC0603X30N]
R80  330R  [T_RESC0603X30N]
R81  0R  [T_RESC0603X30N]
R82  330R  [T_RESC0603X30N]
R83  0R  [T_RESC0603X30N]
R84  100K  [T_RESC0603X30N]
R85  100K  [T_RESC0603X30N]
R86  12K  [T_RESC0603X30N]
R87  100K  [T_RESC0603X30N]
R88  1MR  [T_RESC0603X30N]
R102  0R  [T_RESC0603X30N]
R103  0R  [T_RESC0603X30N]
R140  100K  [T_RESC0603X30N]
R144  100K  [T_RESC0603X30N]
R145  100K  [T_RESC0603X30N]
R173  100K  [T_RESC0603X30N]
R187  0R  [T_RESC0603X30N]
R188  0R  [T_RESC0603X30N]
RA21  22R  [T_Resistor_Array_X4]  (part A of 4)
RA28  22R  [T_Resistor_Array_X4]  (parts A,D of 4)
T3  Manufacturer Part No.: SI-1024-X  [SOTFL50P160X60-6N]  (hidden comment: T-Vishay-SI-1024X-N)  (parts A,B of 2)
X1  Manufacturer Part No.: 1473005-1  [T_Tyco_1473005-1]  (hidden comment: CON-Tyco-1473005-1-200-0.6mm)  (part C of 16)
X10  SSW-110-01-G-S  [T_Samtec_SSW-110-01-G-S]  (value not drawn)  (parts 47,48,49 of 50)
X11  TSW-110-07-G-D  [T_Samtec_TSW-110-07-G-D]  (value not drawn)  (parts 47,48,49 of 50)
X12  SSW-110-01-G-S  [T_Samtec_SSW-110-01-G-S]  (value not drawn)  (parts 47,48,49 of 50)
X29  61729-0010BLF  [T_FCI_61729-0010BLF]
X30  Manufacturer Part No.: USB3105-30-A  [T_GCT_USB3105-30-A]  (hidden comment: CON-GCT-USB3105-30-A)  (parts A,B of 2)
X31  896-43-008-90-000000  [T_MMMC_896-43-008-90-000000]  (parts A,B of 2)
X32  896-43-008-90-000000  [T_MMMC_896-43-008-90-000000]  (parts A,B of 2)

### Blocks framed on the sheet
X10: X10
X11: X11
X12: X12
USB Client Connector: LED7-LED10 LED15 R72 R78-R80 R82

### Ports
BUS_SODIMM[0..66] (bidir, see 22, 3), I2C[0..1] (bidir, see 13, 22, 5), RESET_OUT# (bidir, see 16, 19, 22, 3)

### Nets
3.3V: C131.2 C132.2 C133.2 C134.2 C135.2 C136.2 C137.2 C138.2 IC13.4(EN_2#) IC14.5(VDDA33) IC14.10(VDDA33) IC14.15(VDD33(REG)) IC14.23(VDD33(IO)) IC14.29(VDDA33) IC14.36(VDDPLLREF/VDDA33) R70.2 R71.1 R84.2 R140.2
5V: IC13.2(V_IN) IC15.2(V_IN) IC16.2(V_IN) L27.2 L33.1 L40.1
5V_ESD_1: C120.2 D12.5 L33.2
5V_ESD_2: C127.2 D13.5 L40.2
5V_ESD_3: C114.2 D10.5 L27.1
GND: C115.2 C116.1 C117.1 C118.2 C121.1 C122.2 C124.1 C125.2 C128.1 C129.2 C131.1 C132.1 C133.1 C134.1 C135.1 C136.1 C137.1 C138.1 C139.1 C140.1 C141.1 C142.1 C143.1 C144.1 IC13.1(GND) IC14.11(TEST) IC14.37(VSS(FLAG)) IC15.1(GND) IC16.1(GND) L31.1 L36.1 L38.1 L43.1 LED7.K LED8.K LED9.K LED10.K LED15.K R68.1 R69.1 R74.1 R85.2 R86.1 R87.1 R144.2 R145.2 R173.1 T3.1(S) X29.4(GND) X30.5(GND)
GND_USB1: C119.1 L31.2 X31.U4(GND)
GND_USB2: C123.1 L36.2 X31.L4(GND)
GND_USB3: C126.1 L38.2 X32.U4(GND)
GND_USB4: C130.1 L43.2 X32.L4(GND)
SHIELD2: C114.1 C120.1 C127.1 D10.2 D12.2 D13.2 X29.S1 X29.S2 X30.S1(SHIELD) X30.S2(SHIELD) X31.S1(SHIELD) X31.S2(SHIELD) X31.S3(SHIELD) X31.S4(SHIELD) X32.S1(SHIELD) X32.S2(SHIELD) X32.S3(SHIELD) X32.S4(SHIELD)
VCC_USB1: C119.2 L32.2 R78.2 X31.U1(VCC)
VCC_USB2: C123.2 L34.2 R79.2 X31.L1(VCC)
VCC_USB3: C126.2 L39.2 R80.2 X32.U1(VCC)
VCC_USB4: C130.2 L41.2 R82.2 X32.L1(VCC)
VCC_USB5: C116.2 L29.2 R72.2 R73.2 X29.1(VCC) X30.1(VCC)
I2C_SCL: R83.1
I2C_SDA: R81.1
RESET_OUT#: IC14.26(~{RESET}) ; port RESET_OUT#
SODIMM_129: RA21.5 X10.47 X11.B47
SODIMM_129_S: RA21.1 X1.129(PIN_129/USB_P_EN)
SODIMM_131: RA28.8 X10.48 X11.B48
SODIMM_131_S: RA28.4 X1.131(PIN_131/USB_OC)
SODIMM_135: JP2.1
SODIMM_137: RA28.5 X10.49 X11.B49
SODIMM_137_S: RA28.1 X1.137(PIN_137/USBC_CABLEDET)
USB1_C_N: D12.1 L30.3 X31.U2(D-)
USB1_C_P: D12.6 L30.4 X31.U3(D+)
USB1_EN: IC14.12(PRTPWR1) IC15.3(EN_1)
USB1_N: IC14.1(USBDN1_DM) L30.2
USB1_OC#: IC14.13(~{OCS1}) IC15.8(OC_1#)
USB1_P: IC14.2(USBDN1_DP) L30.1
USB2_C_N: D12.4 L35.3 X31.L2(D-)
USB2_C_P: D12.3 L35.4 X31.L3(D+)
USB2_EN: IC14.16(PRTPWR2) IC15.4(EN_2)
USB2_N: IC14.3(USBDN2_DM) L35.2
USB2_OC#: IC14.17(~{OCS2}) IC15.5(OC_2#)
USB2_P: IC14.4(USBDN2_DP) L35.1
USB3_C_N: D13.1 L37.3 X32.U2(D-)
USB3_C_P: D13.6 L37.4 X32.U3(D+)
USB3_EN: IC14.18(PRTPWR3) IC16.3(EN_1)
USB3_N: IC14.6(USBDN3_DM) L37.2
USB3_OC#: IC14.19(~{OCS3}) IC16.8(OC_1#)
USB3_P: IC14.7(USBDN3_DP) L37.1
USB4_C_N: D13.4 L42.3 X32.L2(D-)
USB4_C_P: D13.3 L42.4 X32.L3(D+)
USB4_EN: IC14.20(PRTPWR4) IC16.4(EN_2)
USB4_N: IC14.8(USBDN4_DM) L42.2
USB4_OC#: IC14.21(~{OCS4}) IC16.5(OC_2#)
USB4_P: IC14.9(USBDN4_DP) L42.1
USB_C_DET: D10.3 D11.1 R73.1 R74.2 X11.A49 X12.49
USB_CFG_SEL1: IC14.25(HS_IND/CFG_SEL1) R84.1 R85.1
USB_ID: D10.6 D11.3 IC13.3(EN_1#) JP2.2 R71.2 X30.4(ID)
USB_OC#: IC13.8(OC_1#) R70.1 X11.A48 X12.48
USB_PE: IC14.27(VBUS_DET) R140.1 T3.6(D)
USB_PE#: R173.2 T3.2(G) X11.A47 X12.47
USB_SCL: IC14.24(SCL/SMBCLK/CFG_SEL0) R83.2 R145.1
USB_SDA: IC14.22(SDA/SMBDATA/NON_REM1) R81.2 R144.1
USBC_B_N: R187.2 X29.2(D-)
USBC_B_P: R188.2 X29.3(D+)
USBC_C_N: D10.4 L28.4 R68.2 R187.1 X30.2(D-)
USBC_C_P: D10.1 L28.3 R69.2 R188.1 X30.3(D+)
USBC_N: L28.1 X1.145(USBC_N)
USBC_P: L28.2 X1.143(USBC_P)
USBH_N: IC14.30(USBUP_DM) R103.2
USBH_P: IC14.31(USBUP_DP) R102.2
USBH_S_N: R103.1 X1.141(USBH_N)
USBH_S_P: R102.1 X1.139(USBH_P)
XTAL1: C139.2 IC14.33(XTAL1/CLKIN) OSC2.2(OSC2) R88.2
XTAL2: C142.2 IC14.32(XTAL2/CLKIN_EN) OSC2.1(OSC1) R88.1
NetC115_1: C115.1 IC13.7(OUT_1) L29.1
NetC117_2: C117.2 C118.1 IC15.7(OUT_1) L32.1
NetC121_2: C121.2 C122.1 IC15.6(OUT_2) L34.1
NetC124_2: C124.2 C125.1 IC16.7(OUT_1) L39.1
NetC128_2: C128.2 C129.1 IC16.6(OUT_2) L41.1
NetC140_2: C140.2 C141.2 IC14.14(CRFILT)
NetC143_2: C143.2 C144.2 IC14.34(PLLFILT)
NetIC14_28: IC14.28(LOCAL_PWR/NON_REM0/SUSP_IND_N) R87.2
NetIC14_35: IC14.35(RBIAS) R86.2
NetLED7_A: LED7.A R78.1
NetLED8_A: LED8.A R79.1
NetLED9_A: LED9.A R80.1
NetLED10_A: LED10.A R82.1
NetLED15_A: LED15.A R72.1

Not connected (* = marked no-connect by the designer): IC13 5(OC_2#)* 6(OUT_2)*; T3 3(D)* 4(S)* 5(G)*

### Buses and harness runs
bus BUS_SODIMM[0..66] = port BUS_SODIMM[0..66]
bus I2C[0..1] = port I2C[0..1]
bus USB_C[0..1]
bus USB_PWR[0..2]
bus USB_PWR_SODIMM[0..2]

### Layout directives
differential pair: USB1_C_N, USB1_C_P, USB1_N, USB1_P, USB2_C_N, USB2_C_P, USB2_N, USB2_P, USB3_C_N, USB3_C_P, USB3_N, USB3_P, USB4_C_N, USB4_C_P, USB4_N, USB4_P, USBC_B_N, USBC_B_P, USBC_C_N, USBC_C_P, USBC_N, USBC_P, USBH_N, USBH_P, USBH_S_N, USBH_S_P

### Notes on the sheet
- (near JP2) USB ID Jumper
- (near JP2) 2.54mm Male
- (near R72) Optional
- USB OTG Connector
- NOTE 1: It is recommended to assemble 0R resistor
- instead of 22R for R102 and R103.
- USB 1/2 Connector
- (near R81) share pads
- USB 3/4 Connector
- (near R83) share pads
- share pads
- Title
- Size:
- Date:
- A3
- Number:
- Time:
- Revision:
- Sheet
- of
- File:
- (in symbol C-TA-100uF-10V-10%-6032) +
- (in symbol CON-Samtec-SSW-110-01-G-S, part 47) 47 of 50
- (in symbol CON-Samtec-SSW-110-01-G-S, part 48) 48 of 50
- (in symbol CON-Samtec-SSW-110-01-G-S, part 49) 49 of 50
- (in symbol CON-Samtec-TSW-110-07-G-D, part 47) 47 of 50
- (in symbol CON-Samtec-TSW-110-07-G-D, part 48) 48 of 50
- (in symbol CON-Samtec-TSW-110-07-G-D, part 49) 49 of 50
- (in symbol CON-Tyco-1473005-1-200-0.6mm, part C) Colibri - USB; 3 of 16
- (in symbol IC-SMSC-USB2514B-AEZC) Upstream; Downstream 1; Downstream 2; Downstream 3; Downstream 4; EEPROM/Config; Common

### Library data of the parts
C114 C116 C117 C120 C121 C124 C127 C128 C132 C133 C135-C138 C141 C144 = C-X7R-100nF-16V-10%-0603: Capacitor Ceramic X7R 100nF 16V 10% 0603; Tolerance: 10%; Type: X7R; Value: 100nF
C115 C118 C122 C125 C129 = C-TA-100uF-10V-10%-6032: Capacitor TA 100uF 10V 10% 6032; Tolerance: 10%; Type: TA; Value: 100uF
C119 C123 C126 C130 = C-X7R-1nF-50V-10%-0603: Capacitor Ceramic X7R 1nF 50V 10% 0603; Tolerance: 10%; Type: X7R; Value: 1nF
C131 = C-X5R-4.7uF-6.3V-20%-0603: Capacitor Ceramic X5R 4.7uF 6.3V 20% 0603; Tolerance: 20%; Type: X5R; Value: 4.7uF
C134 C140 C143 = C-X5R-1uF-16V-20%-0603: Capacitor Ceramic X5R 1uF 16V 20% 0603; Tolerance: 20%; Type: X5R; Value: 1uF
C139 C142 = C-NP0-33pF-25V-10%-0603: Capacitor Ceramic NP0 33pF 25V 10% 0603; Tolerance: 10%; Type: NP0; Value: 33pF
D10 D12 D13 = D-Semtech-RClamp0504S: TVS Array low cap; Manufacturer Name: Semtech; Manufacturer Part No.: RCLAMP0504S
D11 = D-Philips-BAT54-Schottky: BAT54 Schottky Diode; Manufacturer Name: Philips; Manufacturer Part No.: BAT54
IC13 = IC-TI-TPS2042BD: Dual High Side Switch With OC_DET 500mA/CH; Manufacturer Name: Texas Instruments; Manufacturer Part No.: TPS2042BD
IC14 = IC-SMSC-USB2514B-AEZC: 4 Port USB HUB; Manufacturer Name: SMSC
IC15 IC16 = IC-TI-TPS2052BD: Dual High Side Switch With OC_DET 500mA/CH; Manufacturer Name: Texas Instruments; Manufacturer Part No.: TPS2052BD
JP2 = CON-Samtec-TSW-101-07-G-D: as JP3 on sheet Ethernet; No. of ways: 1x2; Manufacturer Part no.: TSW-101-07-G-D
L27 L33 L40 = L-Panasonic-EXC-ML20A390U-39R@100MHz-4A-25%-0805: 39R@100MHz 4A EMI FILTER; Tolerance: 25%; Rating: 4A; Manufacturer Name: Panasonic; Manufacturer Name: EXC-ML20A390U; Value: 39R@100MHz
L28 L30 L35 L37 L42 = L-Murata-DLW21SN900SQ2-90R@100MHz-330mA-25%: Common Mode Choke High Speed 90R 330mA; Manufacturer Name: Murata; Tolerance: 25%; Rating: 330mA; Manufacturer Part No.: DLW21SN900SQ2; Value: 90R@100MHz
L29 L31 L32 L34 L36 L38 L39 L41 L43 = L-220R@100MHz-2A-25%-0603: as L12 on sheet LVDS; Rating: 2A; Value: 220R@100MHz
LED7-LED10 LED15 = LED-Osram-T670-K1L2-1: LED green Osram LG T670-K1L2-1; Manufacturer Part N.: LG T670-K1L2-1; Manufacturer Name: Osram
OSC2 = OSC-HORIZON-HEX24-24000MHz-18-50R-F-H2-T2-W2-T: Quartz 24.0 MHz; Tolerance: 30ppm; Manufacturer Name: HORIZON; Manufacturer Part No.: HEX24-24000MHz-18-50R-F-H2-T2-W2-T
R68 R69 = R-15KR-63mW-5%-0603: Resistor 15 Kohm 63mW 5% 0603; Value: 15KR; Rating: 63mW; Tolerance: 5%
R70 R71 R84 R85 R87 R140 R144 R145 R173 = R-100KR-63mW-5%-0603: as R141 on sheet Extension; Rating: 63mW; Tolerance: 5%
R72 R78-R80 R82 = R-330R-63mW-5%-0603: Resistor 330 ohm 63mW 5% 0603; Rating: 63mW; Tolerance: 5%; Value: 330R
R73 = R-560R-63mW-5%-0603: Resistor 560 ohm 63mW 5% 0603; Rating: 63mW; Tolerance: 5%; Value: 560R
R74 = R-1KR-63mW-5%-0603: Resistor 1 Kohm 63mW 5% 0603; Rating: 63mW; Tolerance: 5%; Value: 1K
R81 R83 R102 R103 R187 R188 = R-0R-63mW-1%-0603: Resistor 0 ohm 63mW 1% 0603; Rating: 63mW; Tolerance: 1%; Value: 0R
R86 = R-12KR-63mW-1%-0603: Resistor 12 Kohm 63mW 1% 0603; Value: 12KR; Rating: 63mW; Tolerance: 1%
R88 = R-1MR-63mW-5%-0603: Resistor 1Mohm 63mW 5% 0603; Rating: 63mW; Tolerance: 5%; Value: 1MR
RA21 RA28 = RA-22R-63mW-5%-1206-div: Resistor Array 22 R 63mW 5% 1206; Tolerance: 5%; Power Dissipation: 63mW; Value: 22R
T3 = T-Vishay-SI-1024X-N: Dual N-Channel 20V (D-S)  MOSFET; Manufacturer Name: Vishay
X1 = CON-Tyco-1473005-1-200-0.6mm: as X1 on sheet Generic_Display
X10 X12 = CON-Samtec-SSW-110-01-G-S: as X10 on sheet SDCard; Pitch: 2.54mm; No. of ways: 1x50; Manufacturer Part No.: SSW-110-01-G-S
X11 = CON-Samtec-TSW-110-07-G-D: as X11 on sheet SDCard; Pitch: 2.54mm; No. of ways: 2x50; Manufacturer Part No.: TSW-110-07-G-D
X29 = CON-FCI-61729-0010BLF: USB Type B Connector; Manufacturer Name: FCI; No. of ways: 4; Manufacturer Part No.: 61729-0010BLF
X30 = CON-GCT-USB3105-30-A: Micro USB OTG Connector - TH - Vertical; Manufacturer Name: GCT; No. of ways: 5
X31 X32 = CON-MMMC-896-43-008-90-000000: USB 2.0 double row, Type A; Manufacturer Name: Mill-Max Mfg. Corp.; No. of ways: 8; Manufacturer Part No.: 896-43-008-90-000000